# EAGLE design PT_2016_PB_4lyr_Rev3 (EAGLE 6.5.0)
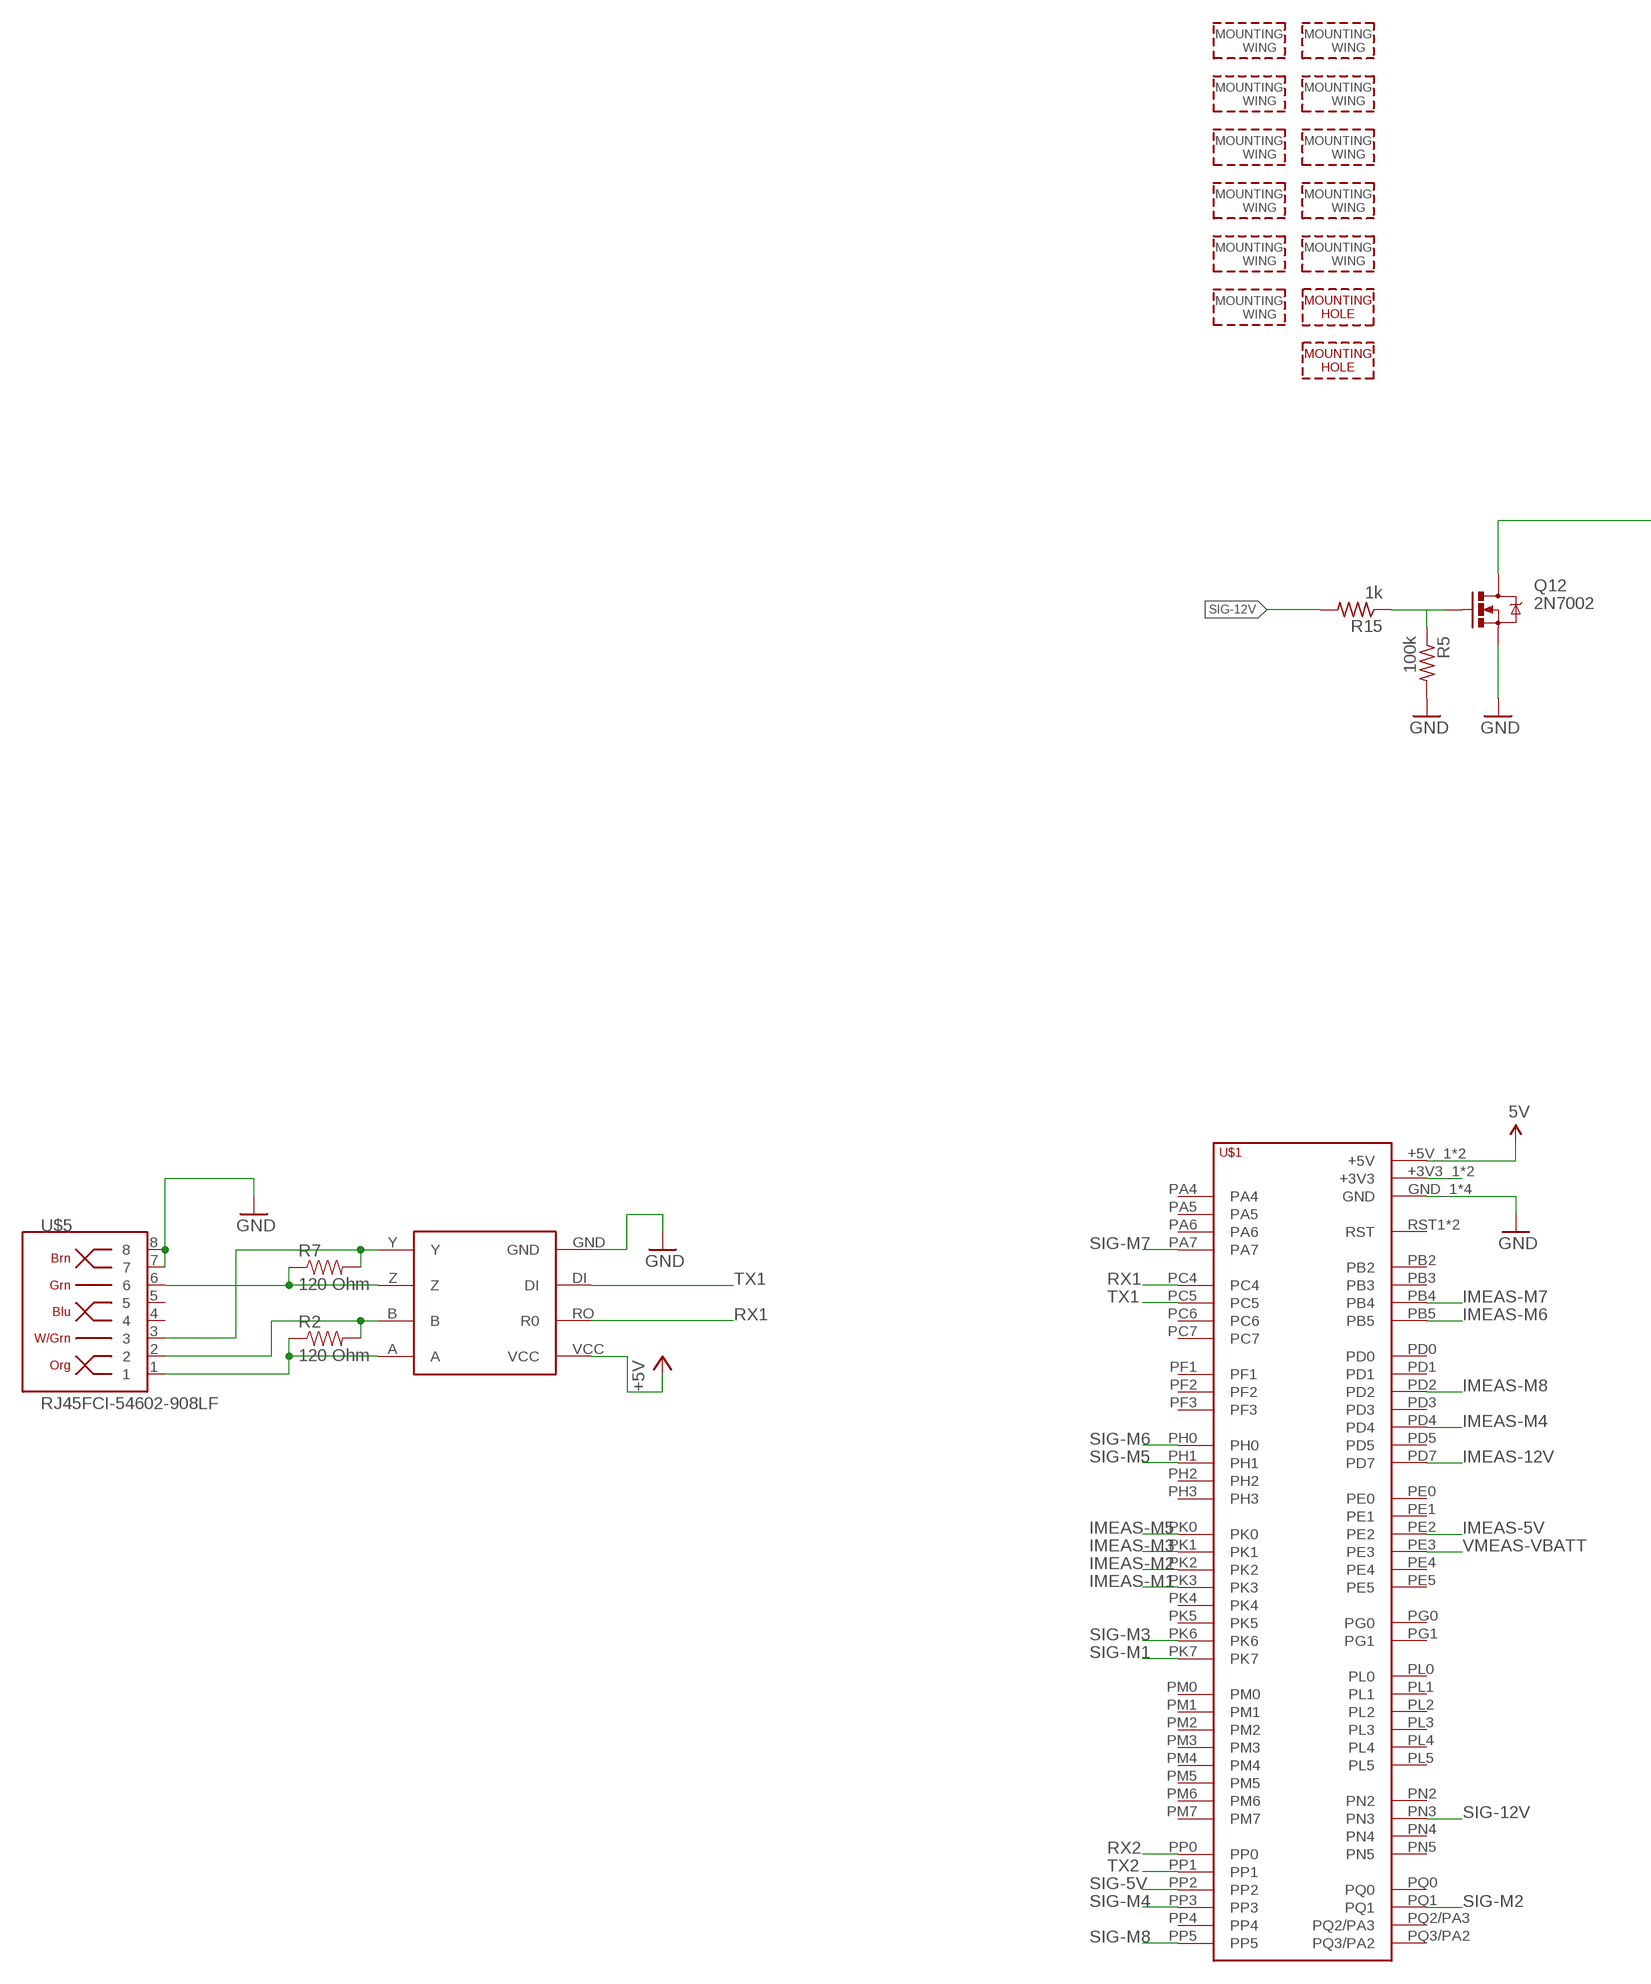
[diagram p0: schematic, sheet 1, part 1 of 3]
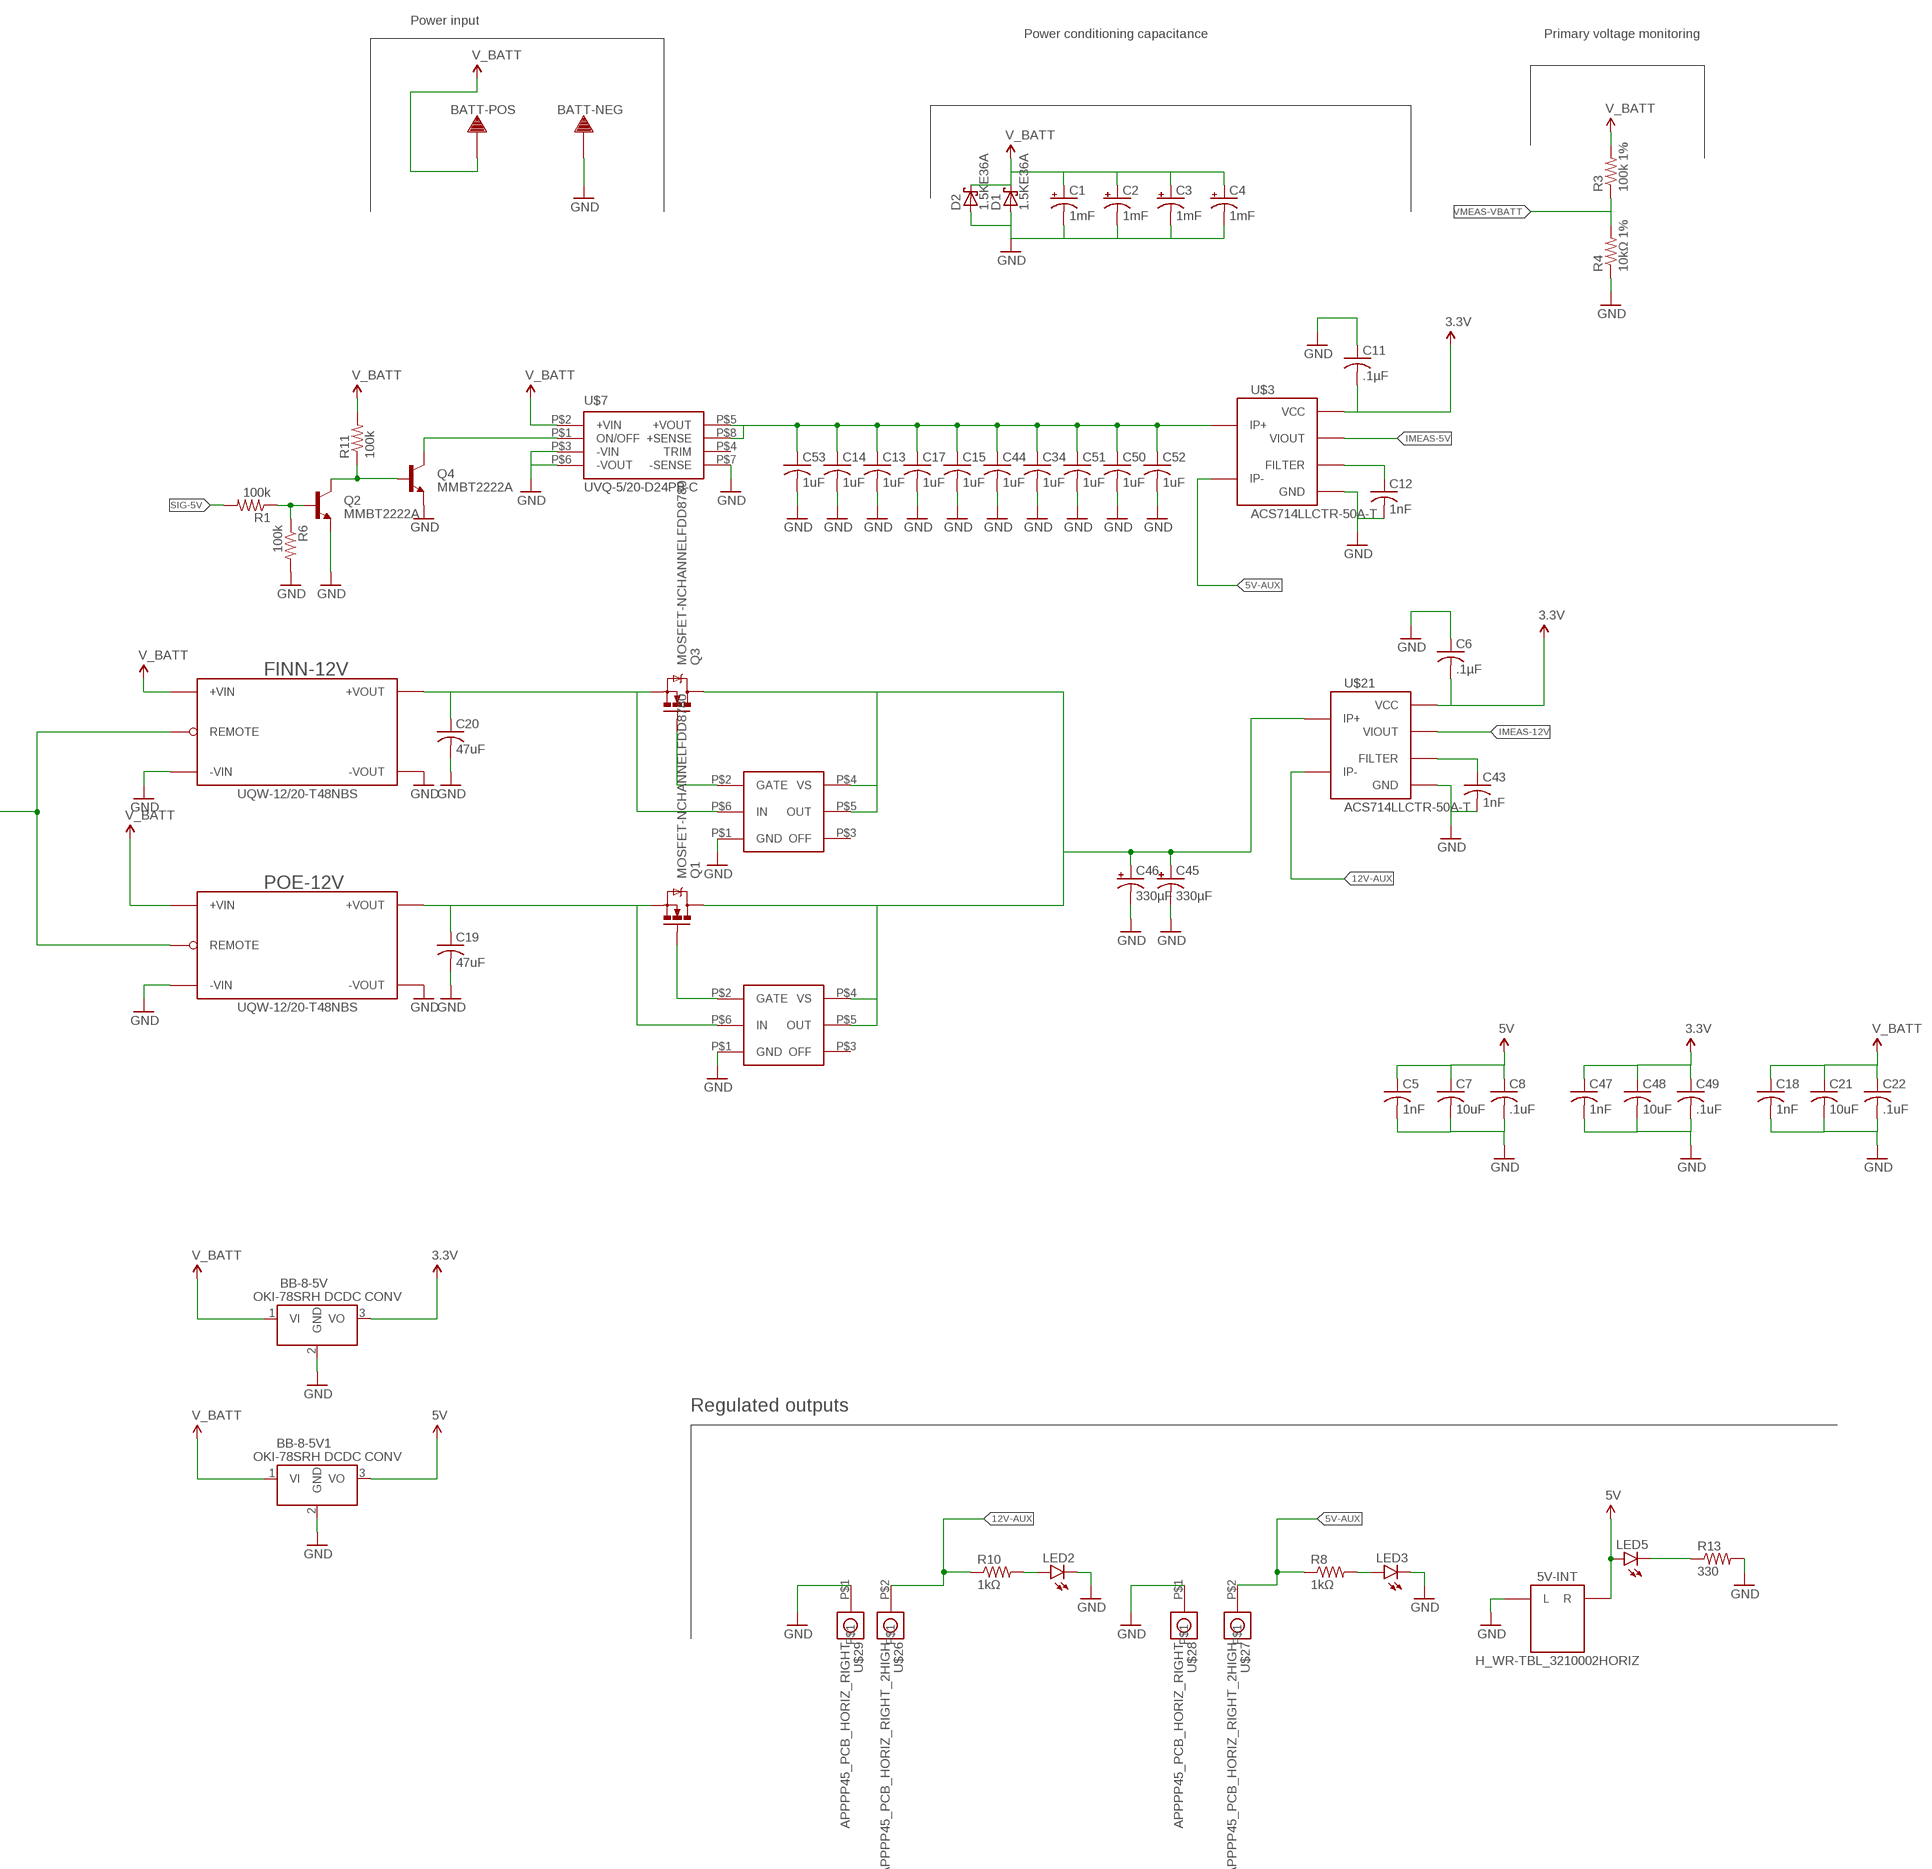
[diagram p1: schematic, sheet 1, part 2 of 3]
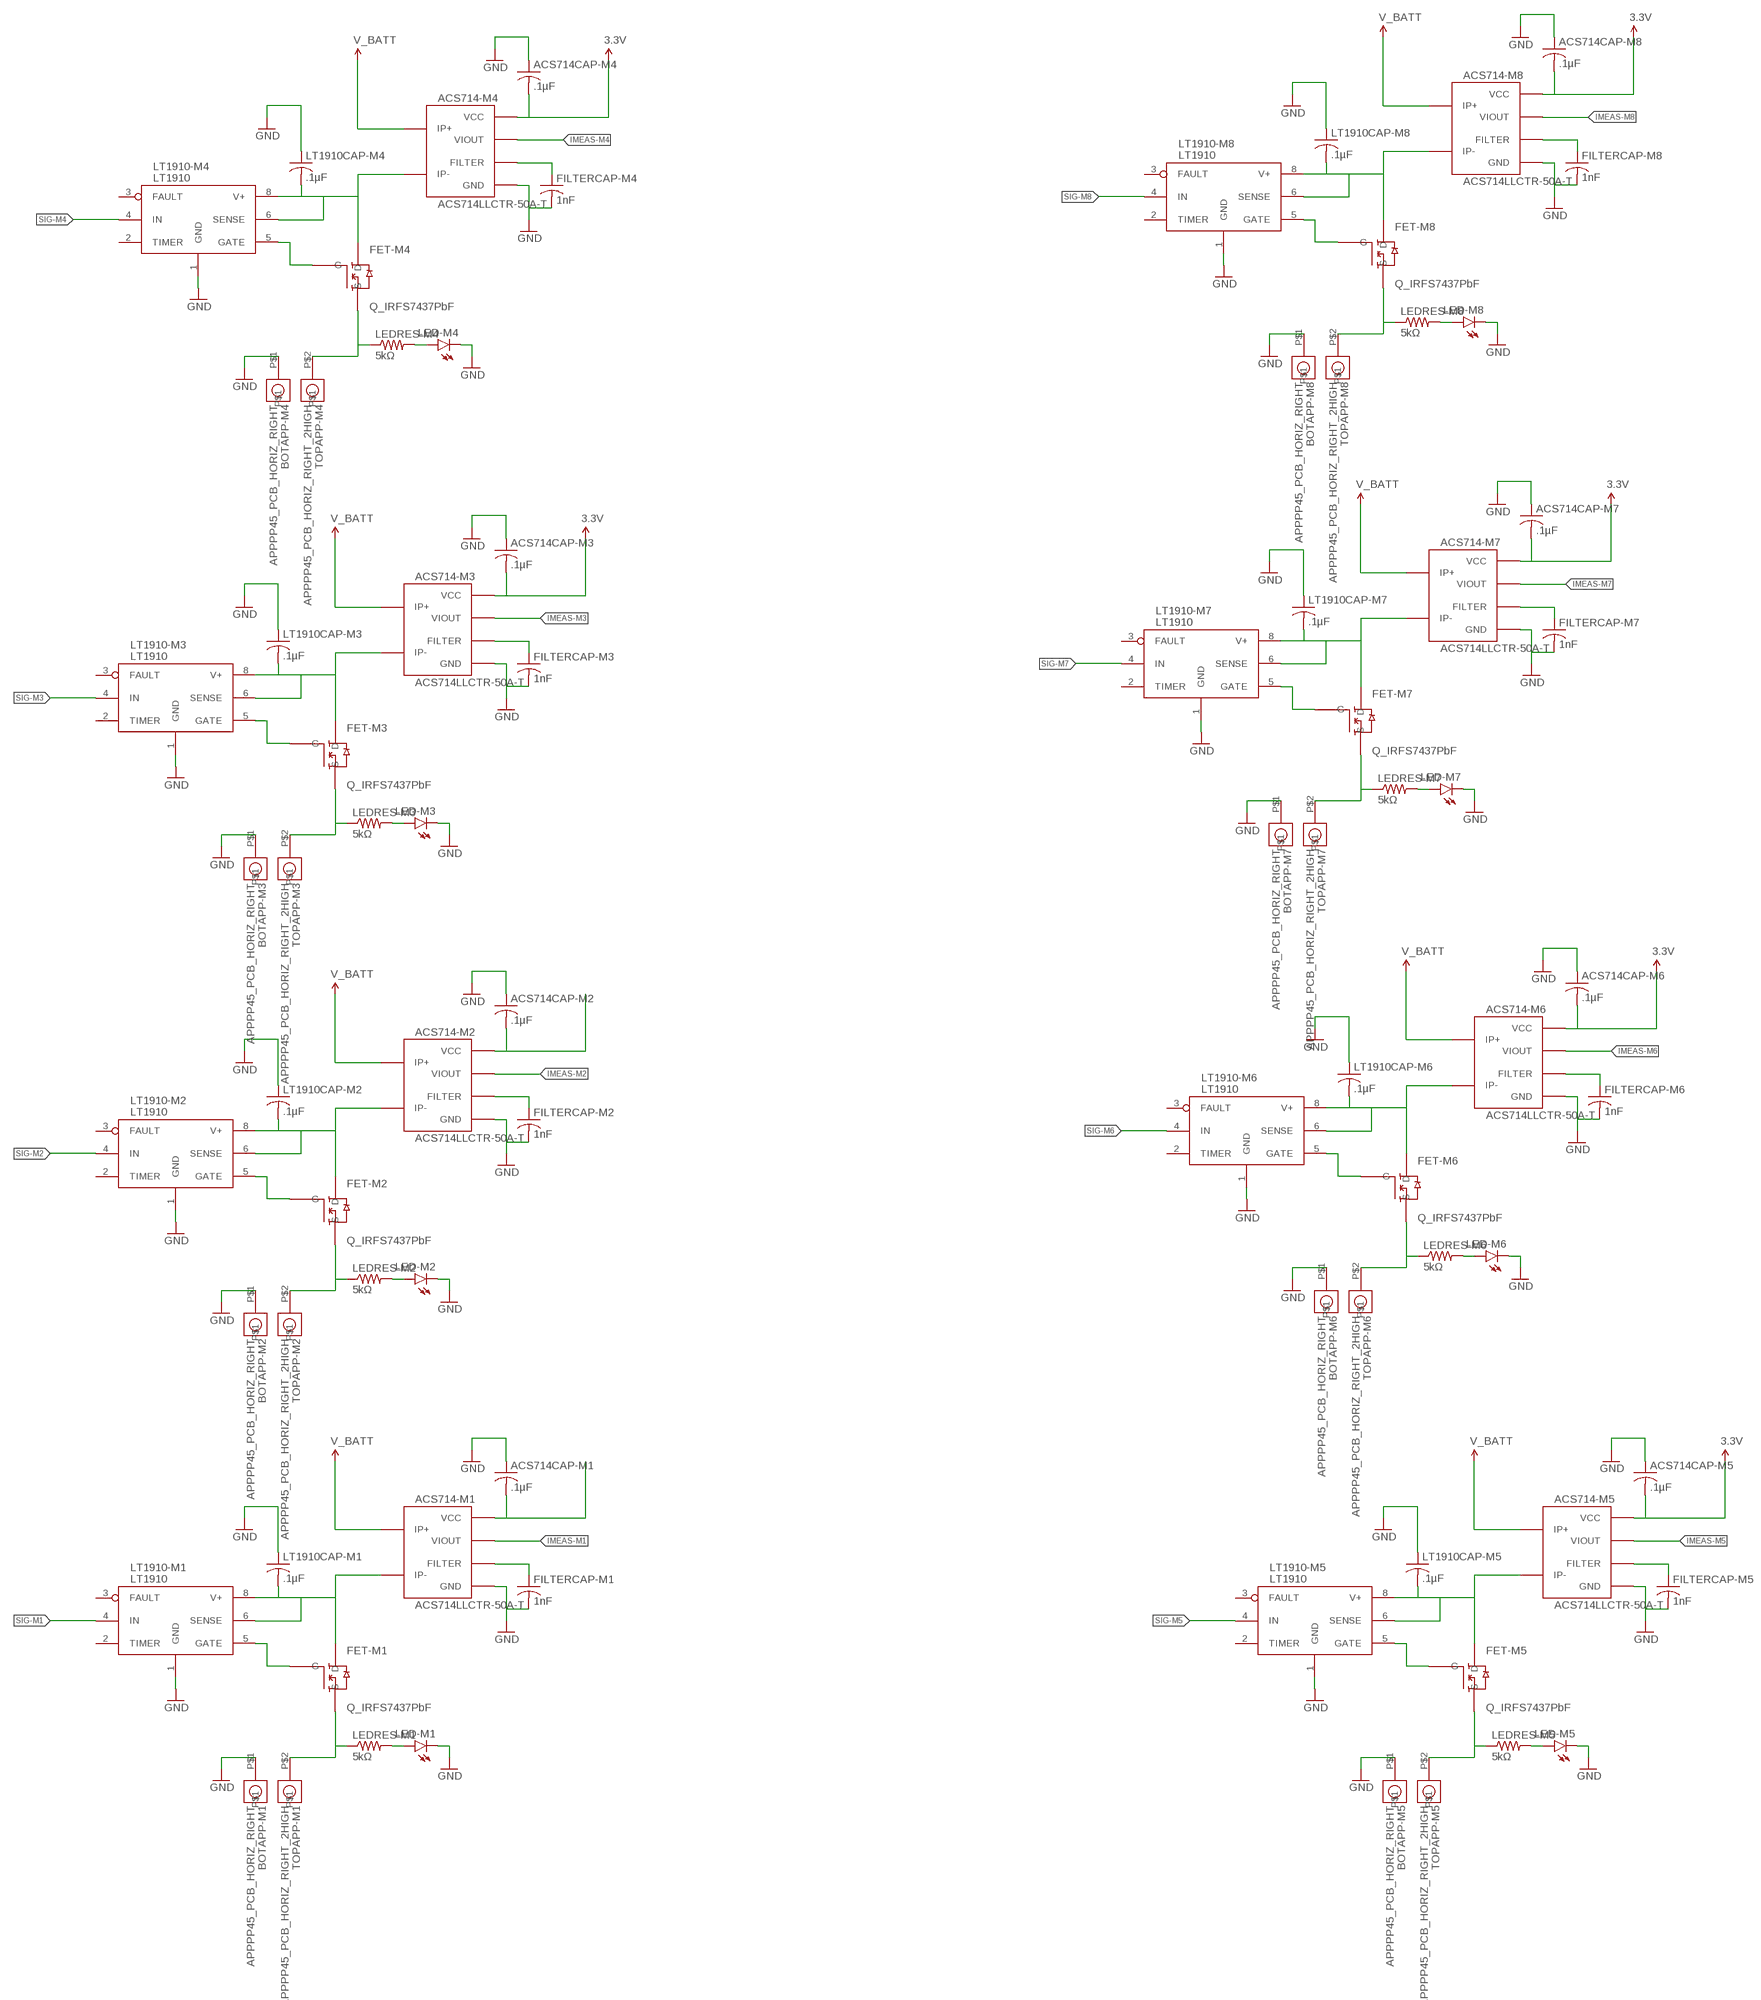
[diagram p2: schematic, sheet 1, part 3 of 3]

## Parts
5V-INT  H_WR-TBL_3210002HORIZ  [691322110002]
ACS714-M1  ACS714LLCTR-50A-T  Q_ACS714  [SOIC8_ACS711]
ACS714-M2  ACS714LLCTR-50A-T  Q_ACS714  [SOIC8_ACS711]
ACS714-M3  ACS714LLCTR-50A-T  Q_ACS714  [SOIC8_ACS711]
ACS714-M4  ACS714LLCTR-50A-T  Q_ACS714  [SOIC8_ACS711]
ACS714-M5  ACS714LLCTR-50A-T  Q_ACS714  [SOIC8_ACS711]
ACS714-M6  ACS714LLCTR-50A-T  Q_ACS714  [SOIC8_ACS711]
ACS714-M7  ACS714LLCTR-50A-T  Q_ACS714  [SOIC8_ACS711]
ACS714-M8  ACS714LLCTR-50A-T  Q_ACS714  [SOIC8_ACS711]
ACS714CAP-M1  .1µF  C-USC1206  [C1206]
ACS714CAP-M2  .1µF  C-USC1206  [C1206]
ACS714CAP-M3  .1µF  C-USC1206  [C1206]
ACS714CAP-M4  .1µF  C-USC1206  [C1206]
ACS714CAP-M5  .1µF  C-USC1206  [C1206]
ACS714CAP-M6  .1µF  C-USC1206  [C1206]
ACS714CAP-M7  .1µF  C-USC1206  [C1206]
ACS714CAP-M8  .1µF  C-USC1206  [C1206]
BATT-NEG  TERMINAL_HOLE  [LARGE_TERMINAL_HOLE]
BATT-POS  TERMINAL_HOLE  [LARGE_TERMINAL_HOLE]
BB-8-5V  Q_OKI-78SR  [OKI-78SR_HORIZ]
BB-8-5V1  Q_OKI-78SR  [OKI-78SR_HORIZ]
BOTAPP-M1  APPPP45_PCB_HORIZ_RIGHT  [APP45_PCB_HORIZ_RIGHT]
BOTAPP-M2  APPPP45_PCB_HORIZ_RIGHT  [APP45_PCB_HORIZ_RIGHT]
BOTAPP-M3  APPPP45_PCB_HORIZ_RIGHT  [APP45_PCB_HORIZ_RIGHT]
BOTAPP-M4  APPPP45_PCB_HORIZ_RIGHT  [APP45_PCB_HORIZ_RIGHT]
BOTAPP-M5  APPPP45_PCB_HORIZ_RIGHT  [APP45_PCB_HORIZ_RIGHT]
BOTAPP-M6  APPPP45_PCB_HORIZ_RIGHT  [APP45_PCB_HORIZ_RIGHT]
BOTAPP-M7  APPPP45_PCB_HORIZ_RIGHT  [APP45_PCB_HORIZ_RIGHT]
BOTAPP-M8  APPPP45_PCB_HORIZ_RIGHT  [APP45_PCB_HORIZ_RIGHT]
C1  1mF  C_POL12.5MM_NORMAL  [C_12.5MM]
C2  1mF  C_POL12.5MM_NORMAL  [C_12.5MM]
C3  1mF  C_POL12.5MM_NORMAL  [C_12.5MM]
C4  1mF  C_POL12.5MM_NORMAL  [C_12.5MM]
C5  1nF  C-USC1206  [C1206]
C6  .1µF  C-USC1206  [C1206]
C7  10uF  C-USC1206  [C1206]
C8  .1uF  C-USC1206  [C1206]
C11  .1µF  C-USC1206  [C1206]
C12  1nF  C-USC1206  [C1206]
C13  1uF  C-USC1206  [C1206]
C14  1uF  C-USC1206  [C1206]
C15  1uF  C-USC1206  [C1206]
C17  1uF  C-USC1206  [C1206]
C18  1nF  C-USC1206  [C1206]
C19  47uF  C-USC1206  [C1206]
C20  47uF  C-USC1206  [C1206]
C21  10uF  C-USC1206  [C1206]
C22  .1uF  C-USC1206  [C1206]
C34  1uF  C-USC1206  [C1206]
C43  1nF  C-USC1206  [C1206]
C44  1uF  C-USC1206  [C1206]
C45  330µF  CPOL-USE5-8.5  [E5-8,5]
C46  330µF  CPOL-USE5-8.5  [E5-8,5]
C47  1nF  C-USC1206  [C1206]
C48  10uF  C-USC1206  [C1206]
C49  .1uF  C-USC1206  [C1206]
C50  1uF  C-USC1206  [C1206]
C51  1uF  C-USC1206  [C1206]
C52  1uF  C-USC1206  [C1206]
C53  1uF  C-USC1206  [C1206]
D1  1.5KE36A  15KEXX  [CB429-17]
D2  1.5KE36A  15KEXX  [CB429-17]
FET-M1  Q_IRFS7437PbF  Q_IRF7437SMD  [D2PACK]
FET-M2  Q_IRFS7437PbF  Q_IRF7437SMD  [D2PACK]
FET-M3  Q_IRFS7437PbF  Q_IRF7437SMD  [D2PACK]
FET-M4  Q_IRFS7437PbF  Q_IRF7437SMD  [D2PACK]
FET-M5  Q_IRFS7437PbF  Q_IRF7437SMD  [D2PACK]
FET-M6  Q_IRFS7437PbF  Q_IRF7437SMD  [D2PACK]
FET-M7  Q_IRFS7437PbF  Q_IRF7437SMD  [D2PACK]
FET-M8  Q_IRFS7437PbF  Q_IRF7437SMD  [D2PACK]
FILTERCAP-M1  1nF  C-USC1206  [C1206]
FILTERCAP-M2  1nF  C-USC1206  [C1206]
FILTERCAP-M3  1nF  C-USC1206  [C1206]
FILTERCAP-M4  1nF  C-USC1206  [C1206]
FILTERCAP-M5  1nF  C-USC1206  [C1206]
FILTERCAP-M6  1nF  C-USC1206  [C1206]
FILTERCAP-M7  1nF  C-USC1206  [C1206]
FILTERCAP-M8  1nF  C-USC1206  [C1206]
FINN-12V  UQW-12/20-T48NBS  [U-T48-QB-NO_TRIM]
LED2  LED1206  [LED-1206]
LED3  LED1206  [LED-1206]
LED5  LED1206  [LED-1206]
LED-M1  LED1206  [LED-1206]
LED-M2  LED1206  [LED-1206]
LED-M3  LED1206  [LED-1206]
LED-M4  LED1206  [LED-1206]
LED-M5  LED1206  [LED-1206]
LED-M6  LED1206  [LED-1206]
LED-M7  LED1206  [LED-1206]
LED-M8  LED1206  [LED-1206]
LEDRES-M1  5kΩ  RESISTOR1206  [1206]
LEDRES-M2  5kΩ  RESISTOR1206  [1206]
LEDRES-M3  5kΩ  RESISTOR1206  [1206]
LEDRES-M4  5kΩ  RESISTOR1206  [1206]
LEDRES-M5  5kΩ  RESISTOR1206  [1206]
LEDRES-M6  5kΩ  RESISTOR1206  [1206]
LEDRES-M7  5kΩ  RESISTOR1206  [1206]
LEDRES-M8  5kΩ  RESISTOR1206  [1206]
LT1910-M1  LT1910  [SO8]
LT1910-M2  LT1910  [SO8]
LT1910-M3  LT1910  [SO8]
LT1910-M4  LT1910  [SO8]
LT1910-M5  LT1910  [SO8]
LT1910-M6  LT1910  [SO8]
LT1910-M7  LT1910  [SO8]
LT1910-M8  LT1910  [SO8]
LT1910CAP-M1  .1µF  C-USC1206  [C1206]
LT1910CAP-M2  .1µF  C-USC1206  [C1206]
LT1910CAP-M3  .1µF  C-USC1206  [C1206]
LT1910CAP-M4  .1µF  C-USC1206  [C1206]
LT1910CAP-M5  .1µF  C-USC1206  [C1206]
LT1910CAP-M6  .1µF  C-USC1206  [C1206]
LT1910CAP-M7  .1µF  C-USC1206  [C1206]
LT1910CAP-M8  .1µF  C-USC1206  [C1206]
POE-12V  UQW-12/20-T48NBS  [U-T48-QB-NO_TRIM]
Q1  MOSFET-NCHANNELFDD8780  [DPAK]
Q2  MMBT2222A  TRANSISTOR_NPNMMBT2222A  [SOT23-3]
Q3  MOSFET-NCHANNELFDD8780  [DPAK]
Q4  MMBT2222A  TRANSISTOR_NPNMMBT2222A  [SOT23-3]
Q12  2N7002  MOSFET-NCHANNEL2N7002PW  [SOT323]
R1  100k  RESISTOR1206  [1206]
R2  120 Ohm  RESISTOR1206  [1206]
R3  100k 1%  R-US_R1206  [R1206]
R4  10kΩ 1%  R-US_R1206  [R1206]
R5  100k  R-US_R1206  [R1206]
R6  100k  RESISTOR1206  [1206]
R7  120 Ohm  RESISTOR1206  [1206]
R8  1kΩ  RESISTOR1206  [1206]
R10  1kΩ  RESISTOR1206  [1206]
R11  100k  RESISTOR1206  [1206]
R13  330  RESISTOR1206  [1206]
R15  1k  R-US_R1206  [R1206]
TOPAPP-M1  APPPP45_PCB_HORIZ_RIGHT_2HIGH  [APP45_PCB_HORIZ_RIGHT_2HIGH]
TOPAPP-M2  APPPP45_PCB_HORIZ_RIGHT_2HIGH  [APP45_PCB_HORIZ_RIGHT_2HIGH]
TOPAPP-M3  APPPP45_PCB_HORIZ_RIGHT_2HIGH  [APP45_PCB_HORIZ_RIGHT_2HIGH]
TOPAPP-M4  APPPP45_PCB_HORIZ_RIGHT_2HIGH  [APP45_PCB_HORIZ_RIGHT_2HIGH]
TOPAPP-M5  APPPP45_PCB_HORIZ_RIGHT_2HIGH  [APP45_PCB_HORIZ_RIGHT_2HIGH]
TOPAPP-M6  APPPP45_PCB_HORIZ_RIGHT_2HIGH  [APP45_PCB_HORIZ_RIGHT_2HIGH]
TOPAPP-M7  APPPP45_PCB_HORIZ_RIGHT_2HIGH  [APP45_PCB_HORIZ_RIGHT_2HIGH]
TOPAPP-M8  APPPP45_PCB_HORIZ_RIGHT_2HIGH  [APP45_PCB_HORIZ_RIGHT_2HIGH]
U$1  TIVA-C-CONNECTED  [TIVA-C-CONNECTED]
U$2  APP_MOUTING_WINGHORIZ  [APP45_MOUNTING_WING_HORIZ]
U$3  ACS714LLCTR-50A-T  Q_ACS714  [SOIC8_ACS711]
U$4  APP_MOUTING_WINGHORIZ  [APP45_MOUNTING_WING_HORIZ]
U$5  RJ45FCI-54602-908LF  [FCI-54602-908LF]
U$6  LM5050  [LM5050]
U$7  UVQ-5/20-D24PB-C  [MURATA_5V_DC-DC_CONVERTER]
U$8  MOUNTING_HOLE#8  [#8_SCREW]
U$9  LM5050  [LM5050]
U$10  MOUNTING_HOLE#8  [#8_SCREW]
U$21  ACS714LLCTR-50A-T  Q_ACS714  [SOIC8_ACS711]
U$24  MAX3077  [MAX3070E]
U$25  APP_MOUTING_WINGHORIZ  [APP45_MOUNTING_WING_HORIZ]
U$26  APPPP45_PCB_HORIZ_RIGHT_2HIGH  [APP45_PCB_HORIZ_RIGHT_2HIGH]
U$27  APPPP45_PCB_HORIZ_RIGHT_2HIGH  [APP45_PCB_HORIZ_RIGHT_2HIGH]
U$28  APPPP45_PCB_HORIZ_RIGHT  [APP45_PCB_HORIZ_RIGHT]
U$29  APPPP45_PCB_HORIZ_RIGHT  [APP45_PCB_HORIZ_RIGHT]
U$30  APP_MOUTING_WINGHORIZ  [APP45_MOUNTING_WING_HORIZ]
U$31  APP_MOUTING_WINGHORIZ  [APP45_MOUNTING_WING_HORIZ]
U$32  APP_MOUTING_WINGHORIZ  [APP45_MOUNTING_WING_HORIZ]
U$33  APP_MOUTING_WINGHORIZ  [APP45_MOUNTING_WING_HORIZ]
U$34  APP_MOUTING_WINGHORIZ  [APP45_MOUNTING_WING_HORIZ]
U$35  APP_MOUTING_WINGHORIZ  [APP45_MOUNTING_WING_HORIZ]
U$41  APP_MOUTING_WINGHORIZ  [APP45_MOUNTING_WING_HORIZ]
U$42  APP_MOUTING_WINGHORIZ  [APP45_MOUNTING_WING_HORIZ]

## Nets
3.3V: ACS714-M1.8(VCC) ACS714-M2.8(VCC) ACS714-M3.8(VCC) ACS714-M4.8(VCC) ACS714-M5.8(VCC) ACS714-M6.8(VCC) ACS714-M7.8(VCC) ACS714-M8.8(VCC) ACS714CAP-M1.2 ACS714CAP-M2.2 ACS714CAP-M3.2 ACS714CAP-M4.2 ACS714CAP-M5.2 ACS714CAP-M6.2 ACS714CAP-M7.2 ACS714CAP-M8.2 BB-8-5V.3(VO) C6.2 C11.2 C47.1 C48.1 C49.1 U$3.8(VCC) U$21.8(VCC) U$24.VCC ; supply symbol labelled +5V
5V: 5V-INT.R BB-8-5V1.3(VO) C5.1 C7.1 C8.1 LED5.A U$1.+5V_1(+5V) U$1.+5V_2(+5V)
5V-AUX: R8.1 U$3.4(IP-) U$27.P$2
12V-AUX: R10.1 U$21.4(IP-) U$26.P$2
DRAIN-M1: ACS714-M1.4(IP-) FET-M1.TAB(D) LT1910-M1.6(SENSE) LT1910-M1.8(V+) LT1910CAP-M1.2
DRAIN-M2: ACS714-M2.4(IP-) FET-M2.TAB(D) LT1910-M2.6(SENSE) LT1910-M2.8(V+) LT1910CAP-M2.2
DRAIN-M3: ACS714-M3.4(IP-) FET-M3.TAB(D) LT1910-M3.6(SENSE) LT1910-M3.8(V+) LT1910CAP-M3.2
DRAIN-M4: ACS714-M4.4(IP-) FET-M4.TAB(D) LT1910-M4.6(SENSE) LT1910-M4.8(V+) LT1910CAP-M4.2
DRAIN-M5: ACS714-M5.4(IP-) FET-M5.TAB(D) LT1910-M5.6(SENSE) LT1910-M5.8(V+) LT1910CAP-M5.2
DRAIN-M6: ACS714-M6.4(IP-) FET-M6.TAB(D) LT1910-M6.6(SENSE) LT1910-M6.8(V+) LT1910CAP-M6.2
DRAIN-M7: ACS714-M7.4(IP-) FET-M7.TAB(D) LT1910-M7.6(SENSE) LT1910-M7.8(V+) LT1910CAP-M7.2
DRAIN-M8: ACS714-M8.4(IP-) FET-M8.TAB(D) LT1910-M8.6(SENSE) LT1910-M8.8(V+) LT1910CAP-M8.2
FILTER-M1: ACS714-M1.6(FILTER) FILTERCAP-M1.1
FILTER-M2: ACS714-M2.6(FILTER) FILTERCAP-M2.1
FILTER-M3: ACS714-M3.6(FILTER) FILTERCAP-M3.1
FILTER-M4: ACS714-M4.6(FILTER) FILTERCAP-M4.1
FILTER-M5: ACS714-M5.6(FILTER) FILTERCAP-M5.1
FILTER-M6: ACS714-M6.6(FILTER) FILTERCAP-M6.1
FILTER-M7: ACS714-M7.6(FILTER) FILTERCAP-M7.1
FILTER-M8: ACS714-M8.6(FILTER) FILTERCAP-M8.1
GATE-M1: FET-M1.1(G) LT1910-M1.5(GATE)
GATE-M2: FET-M2.1(G) LT1910-M2.5(GATE)
GATE-M3: FET-M3.1(G) LT1910-M3.5(GATE)
GATE-M4: FET-M4.1(G) LT1910-M4.5(GATE)
GATE-M5: FET-M5.1(G) LT1910-M5.5(GATE)
GATE-M6: FET-M6.1(G) LT1910-M6.5(GATE)
GATE-M7: FET-M7.1(G) LT1910-M7.5(GATE)
GATE-M8: FET-M8.1(G) LT1910-M8.5(GATE)
GND: 5V-INT.L ACS714-M1.5(GND) ACS714-M2.5(GND) ACS714-M3.5(GND) ACS714-M4.5(GND) ACS714-M5.5(GND) ACS714-M6.5(GND) ACS714-M7.5(GND) ACS714-M8.5(GND) ACS714CAP-M1.1 ACS714CAP-M2.1 ACS714CAP-M3.1 ACS714CAP-M4.1 ACS714CAP-M5.1 ACS714CAP-M6.1 ACS714CAP-M7.1 ACS714CAP-M8.1 BATT-NEG.P$1 BB-8-5V1.2(GND) BB-8-5V.2(GND) BOTAPP-M1.P$1 BOTAPP-M2.P$1 BOTAPP-M3.P$1 BOTAPP-M4.P$1 BOTAPP-M5.P$1 BOTAPP-M6.P$1 BOTAPP-M7.P$1 BOTAPP-M8.P$1 C1.- C2.- C3.- C4.- C5.2 C6.1 C7.2 C8.2 C11.1 C12.2 C13.2 C14.2 C15.2 C17.2 C18.2 C19.2 C20.2 C21.2 C22.2 C34.2 C43.2 C44.2 C45.- C46.- C47.2 C48.2 C49.2 C50.2 C51.2 C52.2 C53.2 D1.A D2.A FILTERCAP-M1.2 FILTERCAP-M2.2 FILTERCAP-M3.2 FILTERCAP-M4.2 FILTERCAP-M5.2 FILTERCAP-M6.2 FILTERCAP-M7.2 FILTERCAP-M8.2 FINN-12V.3(-VIN) FINN-12V.4(-VOUT) LED2.C LED3.C LED-M1.C LED-M2.C LED-M3.C LED-M4.C LED-M5.C LED-M6.C LED-M7.C LED-M8.C LT1910-M1.1(GND) LT1910-M2.1(GND) LT1910-M3.1(GND) LT1910-M4.1(GND) LT1910-M5.1(GND) LT1910-M6.1(GND) LT1910-M7.1(GND) LT1910-M8.1(GND) LT1910CAP-M1.1 LT1910CAP-M2.1 LT1910CAP-M3.1 LT1910CAP-M4.1 LT1910CAP-M5.1 LT1910CAP-M6.1 LT1910CAP-M7.1 LT1910CAP-M8.1 POE-12V.3(-VIN) POE-12V.4(-VOUT) Q2.2(E) Q4.2(E) Q12.2(S) R4.1 R5.2 R6.2 R13.2 U$1.GND_1(GND) U$1.GND_2(GND) U$1.GND_3(GND) U$1.GND_4(GND) U$3.5(GND) U$5.7 U$5.8 U$6.P$1(GND) U$7.P$3(-VIN) U$7.P$6(-VOUT) U$7.P$7(-SENSE) U$9.P$1(GND) U$21.5(GND) U$24.GND U$28.P$1 U$29.P$1
IMEAS-5V: U$1.PE2 U$3.7(VIOUT)
IMEAS-12V: U$1.PD7 U$21.7(VIOUT)
IMEAS-M1: ACS714-M1.7(VIOUT) U$1.PK3
IMEAS-M2: ACS714-M2.7(VIOUT) U$1.PK2
IMEAS-M3: ACS714-M3.7(VIOUT) U$1.PK1
IMEAS-M4: ACS714-M4.7(VIOUT) U$1.PD4
IMEAS-M5: ACS714-M5.7(VIOUT) U$1.PK0
IMEAS-M6: ACS714-M6.7(VIOUT) U$1.PB5
IMEAS-M7: ACS714-M7.7(VIOUT) U$1.PB4
IMEAS-M8: ACS714-M8.7(VIOUT) U$1.PD2
LEDLINE-M1: LED-M1.A LEDRES-M1.2
LEDLINE-M2: LED-M2.A LEDRES-M2.2
LEDLINE-M3: LED-M3.A LEDRES-M3.2
LEDLINE-M4: LED-M4.A LEDRES-M4.2
LEDLINE-M5: LED-M5.A LEDRES-M5.2
LEDLINE-M6: LED-M6.A LEDRES-M6.2
LEDLINE-M7: LED-M7.A LEDRES-M7.2
LEDLINE-M8: LED-M8.A LEDRES-M8.2
N$1: C20.1 FINN-12V.8(+VOUT) Q3.3(S) U$6.P$6(IN)
N$2: C19.1 POE-12V.8(+VOUT) Q1.3(S) U$9.P$6(IN)
N$3: Q3.1(G) U$6.P$2(GATE)
N$4: FINN-12V.2(REMOTE) POE-12V.2(REMOTE) Q12.3(D)
N$5: Q1.1(G) U$9.P$2(GATE)
N$6: LED5.C R13.1
N$11: Q4.3(C) U$7.P$1(ON/OFF)
N$12: C43.1 U$21.6(FILTER)
N$14: Q2.1(B) R1.1 R6.1
N$15: Q2.3(C) Q4.1(B) R11.1
N$33: C45.+ C46.+ Q1.4(D) Q3.4(D) U$6.P$4(VS) U$6.P$5(OUT) U$9.P$4(VS) U$9.P$5(OUT) U$21.1(IP+)
N$34: LED3.A R8.2
N$38: C12.1 U$3.6(FILTER)
N$46: LED2.A R10.2
N$71: C13.1 C14.1 C15.1 C17.1 C34.1 C44.1 C50.1 C51.1 C52.1 C53.1 U$3.1(IP+) U$7.P$5(+VOUT) U$7.P$8(+SENSE)
N$98: U$1.+3V3_1(+3V3) U$1.+3V3_2(+3V3)
N$114: Q12.1(G) R5.1 R15.1
REC+1: R2.1 U$5.1 U$24.A
REC-1: R2.2 U$5.2 U$24.B
RX1: U$1.PC4 U$24.RO(R0)
RX2: U$1.PP0
SIG-5V: R1.2 U$1.PP2
SIG-12V: R15.2 U$1.PN3
SIG-M1: LT1910-M1.4(IN) U$1.PK7
SIG-M2: LT1910-M2.4(IN) U$1.PQ1
SIG-M3: LT1910-M3.4(IN) U$1.PK6
SIG-M4: LT1910-M4.4(IN) U$1.PP3
SIG-M5: LT1910-M5.4(IN) U$1.PH1
SIG-M6: LT1910-M6.4(IN) U$1.PH0
SIG-M7: LT1910-M7.4(IN) U$1.PA7
SIG-M8: LT1910-M8.4(IN) U$1.PP5
SOURCE-M1: FET-M1.2(S) LEDRES-M1.1 TOPAPP-M1.P$2
SOURCE-M2: FET-M2.2(S) LEDRES-M2.1 TOPAPP-M2.P$2
SOURCE-M3: FET-M3.2(S) LEDRES-M3.1 TOPAPP-M3.P$2
SOURCE-M4: FET-M4.2(S) LEDRES-M4.1 TOPAPP-M4.P$2
SOURCE-M5: FET-M5.2(S) LEDRES-M5.1 TOPAPP-M5.P$2
SOURCE-M6: FET-M6.2(S) LEDRES-M6.1 TOPAPP-M6.P$2
SOURCE-M7: FET-M7.2(S) LEDRES-M7.1 TOPAPP-M7.P$2
SOURCE-M8: FET-M8.2(S) LEDRES-M8.1 TOPAPP-M8.P$2
TRANS+1: R7.2 U$5.3 U$24.Y
TRANS-1: R7.1 U$5.6 U$24.Z
TX1: U$1.PC5 U$24.DI
TX2: U$1.PP1
V_BATT: ACS714-M1.1(IP+) ACS714-M2.1(IP+) ACS714-M3.1(IP+) ACS714-M4.1(IP+) ACS714-M5.1(IP+) ACS714-M6.1(IP+) ACS714-M7.1(IP+) ACS714-M8.1(IP+) BATT-POS.P$1 BB-8-5V1.1(VI) BB-8-5V.1(VI) C1.+ C2.+ C3.+ C4.+ C18.1 C21.1 C22.1 D1.C D2.C FINN-12V.1(+VIN) POE-12V.1(+VIN) R3.2 R11.2 U$7.P$2(+VIN)
VMEAS-VBATT: R3.1 R4.2 U$1.PE3
Unconnected: LT1910-M1.2(TIMER) LT1910-M1.3(FAULT) LT1910-M2.2(TIMER) LT1910-M2.3(FAULT) LT1910-M3.2(TIMER) LT1910-M3.3(FAULT) LT1910-M4.2(TIMER) LT1910-M4.3(FAULT) LT1910-M5.2(TIMER) LT1910-M5.3(FAULT) LT1910-M6.2(TIMER) LT1910-M6.3(FAULT) LT1910-M7.2(TIMER) LT1910-M7.3(FAULT) LT1910-M8.2(TIMER) LT1910-M8.3(FAULT) U$1.PA4 U$1.PA5 U$1.PA6 U$1.PB2 U$1.PB3 U$1.PC6 U$1.PC7 U$1.PD0 U$1.PD1 U$1.PD3 U$1.PD5 U$1.PE0 U$1.PE1 U$1.PE4 U$1.PE5 U$1.PF1 U$1.PF2 U$1.PF3 U$1.PG0 U$1.PG1 U$1.PH2 U$1.PH3 U$1.PK4 U$1.PK5 U$1.PL0 U$1.PL1 U$1.PL2 U$1.PL3 U$1.PL4 U$1.PL5 U$1.PM0 U$1.PM1 U$1.PM2 U$1.PM3 U$1.PM4 U$1.PM5 U$1.PM6 U$1.PM7 U$1.PN2 U$1.PN4 U$1.PN5 U$1.PP4 U$1.PQ0 U$1.PQ2/PA3 U$1.PQ3/PA2 U$1.RST1(RST) U$1.RST_2(RST) U$5.4 U$5.5 U$6.P$3(OFF) U$7.P$4(TRIM) U$9.P$3(OFF)

## Notes on the sheet
- Power input
- Power conditioning capacitance | Primary voltage monitoring
- Regulated outputs

## Library data of the parts
5V-INT = MRDT-2015-PowerBoard:H_WR-TBL_32*1*0002: Wurth Electronic's 2-pin 10A pluggable screw terminal headers. Vertical and Horizantal Part Numbers: 691322110002 (Horizantal) 691321100002 (Vertical); DIGIKEY_PN: 732-2769-ND
ACS714-M1-ACS714-M8 U$3 U$21 = MRDT-2015-PowerBoard:Q_ACS714: Sketch variant has increased clearance for traces.
ACS714CAP-M1-ACS714CAP-M8 C5-C8 C11-C15 C17-C22 C34 C43 C44 C47-C53 FILTERCAP-M1-FILTERCAP-M8 LT1910CAP-M1-LT1910CAP-M8 = resistor:C-US: CAPACITOR, American symbol
BATT-NEG BATT-POS = MRDT-2015-PowerBoard:TERMINAL_HOLE
BB-8-5V BB-8-5V1 = MRDT-2015-PowerBoard:Q_OKI-78SR: 4.95W DC/DC Converter Manufacturer: Murata Part Number: OKI-78SR-5/1.5-W36H-C OKI-78SR-3.3/1.5-W36H-C
BOTAPP-M1-BOTAPP-M8 TOPAPP-M1-TOPAPP-M8 U$26-U$29 = MRDT-Connectors:APP: http://www.powerwerx.com/anderson-powerpoles/
C1-C4 = MRDT-2014-All:C_POL: Alum Elect. Cap with 10mm diameter, 5mm lead spacing and 0.7mm lead diameter
C45 C46 = resistor:CPOL-US: POLARIZED CAPACITOR, American symbol
D1 D2 = diode:15KEXX: DIODE
FET-M1-FET-M8 = MRDT-2015-PowerBoard:Q_IRF*7437: 40V 195A N-CH MOSFET switch with heatsink
FINN-12V POE-12V = MRDT-2015-PowerBoard:UQW-12/20-T48NBS
LED2 LED3 LED5 LED-M1-LED-M8 = SparkFun-LED:LED: LEDs Standard schematic elements and footprints for 5mm, 3mm, 1206, and 0603 sized LEDs. 5mm - Spark Fun Electronics SKU : COM-00529 (and others)
LEDRES-M1-LEDRES-M8 R1 R2 R6-R8 R10 R11 R13 = SparkFun-Passives:RESISTOR: Resistor Basic schematic elements and footprints for 0603, 1206, and PTH resistors.
LT1910-M1-LT1910-M8 = Jake:LT1910
Q1 Q3 = SparkFun-DiscreteSemi:MOSFET-NCHANNEL: Common NMOSFET Parts MFG P/N Store ID Prod ID FDD8780 TRANS-09984 SI7820DN TRANS-11055 FDS6630A IC-08089 2N7002PW TRANS-11151 FQP30N06L COM-10213 TRANS-10060 BSS123LT1G TRANS-08345 BSS138 TRANS-00830 BS170 2N7000; PROD_ID: TRANS-09984
Q2 Q4 = SparkFun-DiscreteSemi:TRANSISTOR_NPN: Generic NPN BJT MMBT2222A - TRANS-08049 (SOT-23, 1A 40V) MPSA42 - TRANS-09116 (SOT-23, 500mA 300V) MMBT5088LT1G - TRANS-11160 (SOT-23, 50 mA 30V) BC547 - COM-08928 <http://www.sparkfun.com/products/8928> (TO-92 45V 100mA) (1.Collector 2.Base 3.Emitter) 2N3904 - COM-00521 <http://www.sparkfun.com/products/521> (TO-92 40V 200mA) (1.Emitter 2.Base 3.Collector) P2N2222A - COM-12852 <http://www.sparkfun.com/products/12852> (TO-92 40V 600mA) (1.Collector 2.Base 3.Emitter); PROD_ID: TRANS-08049
Q12 = SparkFun-DiscreteSemi:MOSFET-NCHANNEL: Common NMOSFET Parts MFG P/N Store ID Prod ID FDD8780 TRANS-09984 SI7820DN TRANS-11055 FDS6630A IC-08089 2N7002PW TRANS-11151 FQP30N06L COM-10213 TRANS-10060 BSS123LT1G TRANS-08345 BSS138 TRANS-00830 BS170 2N7000; PROD_ID: TRANS-11151
R3-R5 R15 = resistor:R-US_: RESISTOR, American symbol
U$1 = MRDT-2015-General:TIVA-C-CONNECTED: TIVA C CONNECTED LAUNCHPAD
U$2 U$4 U$25 U$30-U$35 U$41 U$42 = MRDT-Connectors:APP_MOUTING_WING
U$5 = MRDT-2015-General:RJ45
U$6 U$9 = LM5050:LM5050
U$7 = MRDT-2015-PowerBoard:UVQ-5/20-D24PB-C
U$8 U$10 = MRDT-Hardware:MOUNTING_HOLE: Mounting hole for M6 bolt. Standard use mounting hole for: Tiva C Connected - M6 Anderson Powerpole Mounting Wing - M8 Most frame-mounted PCB's - M8
U$24 = MAX3077:MAX3077

## Board
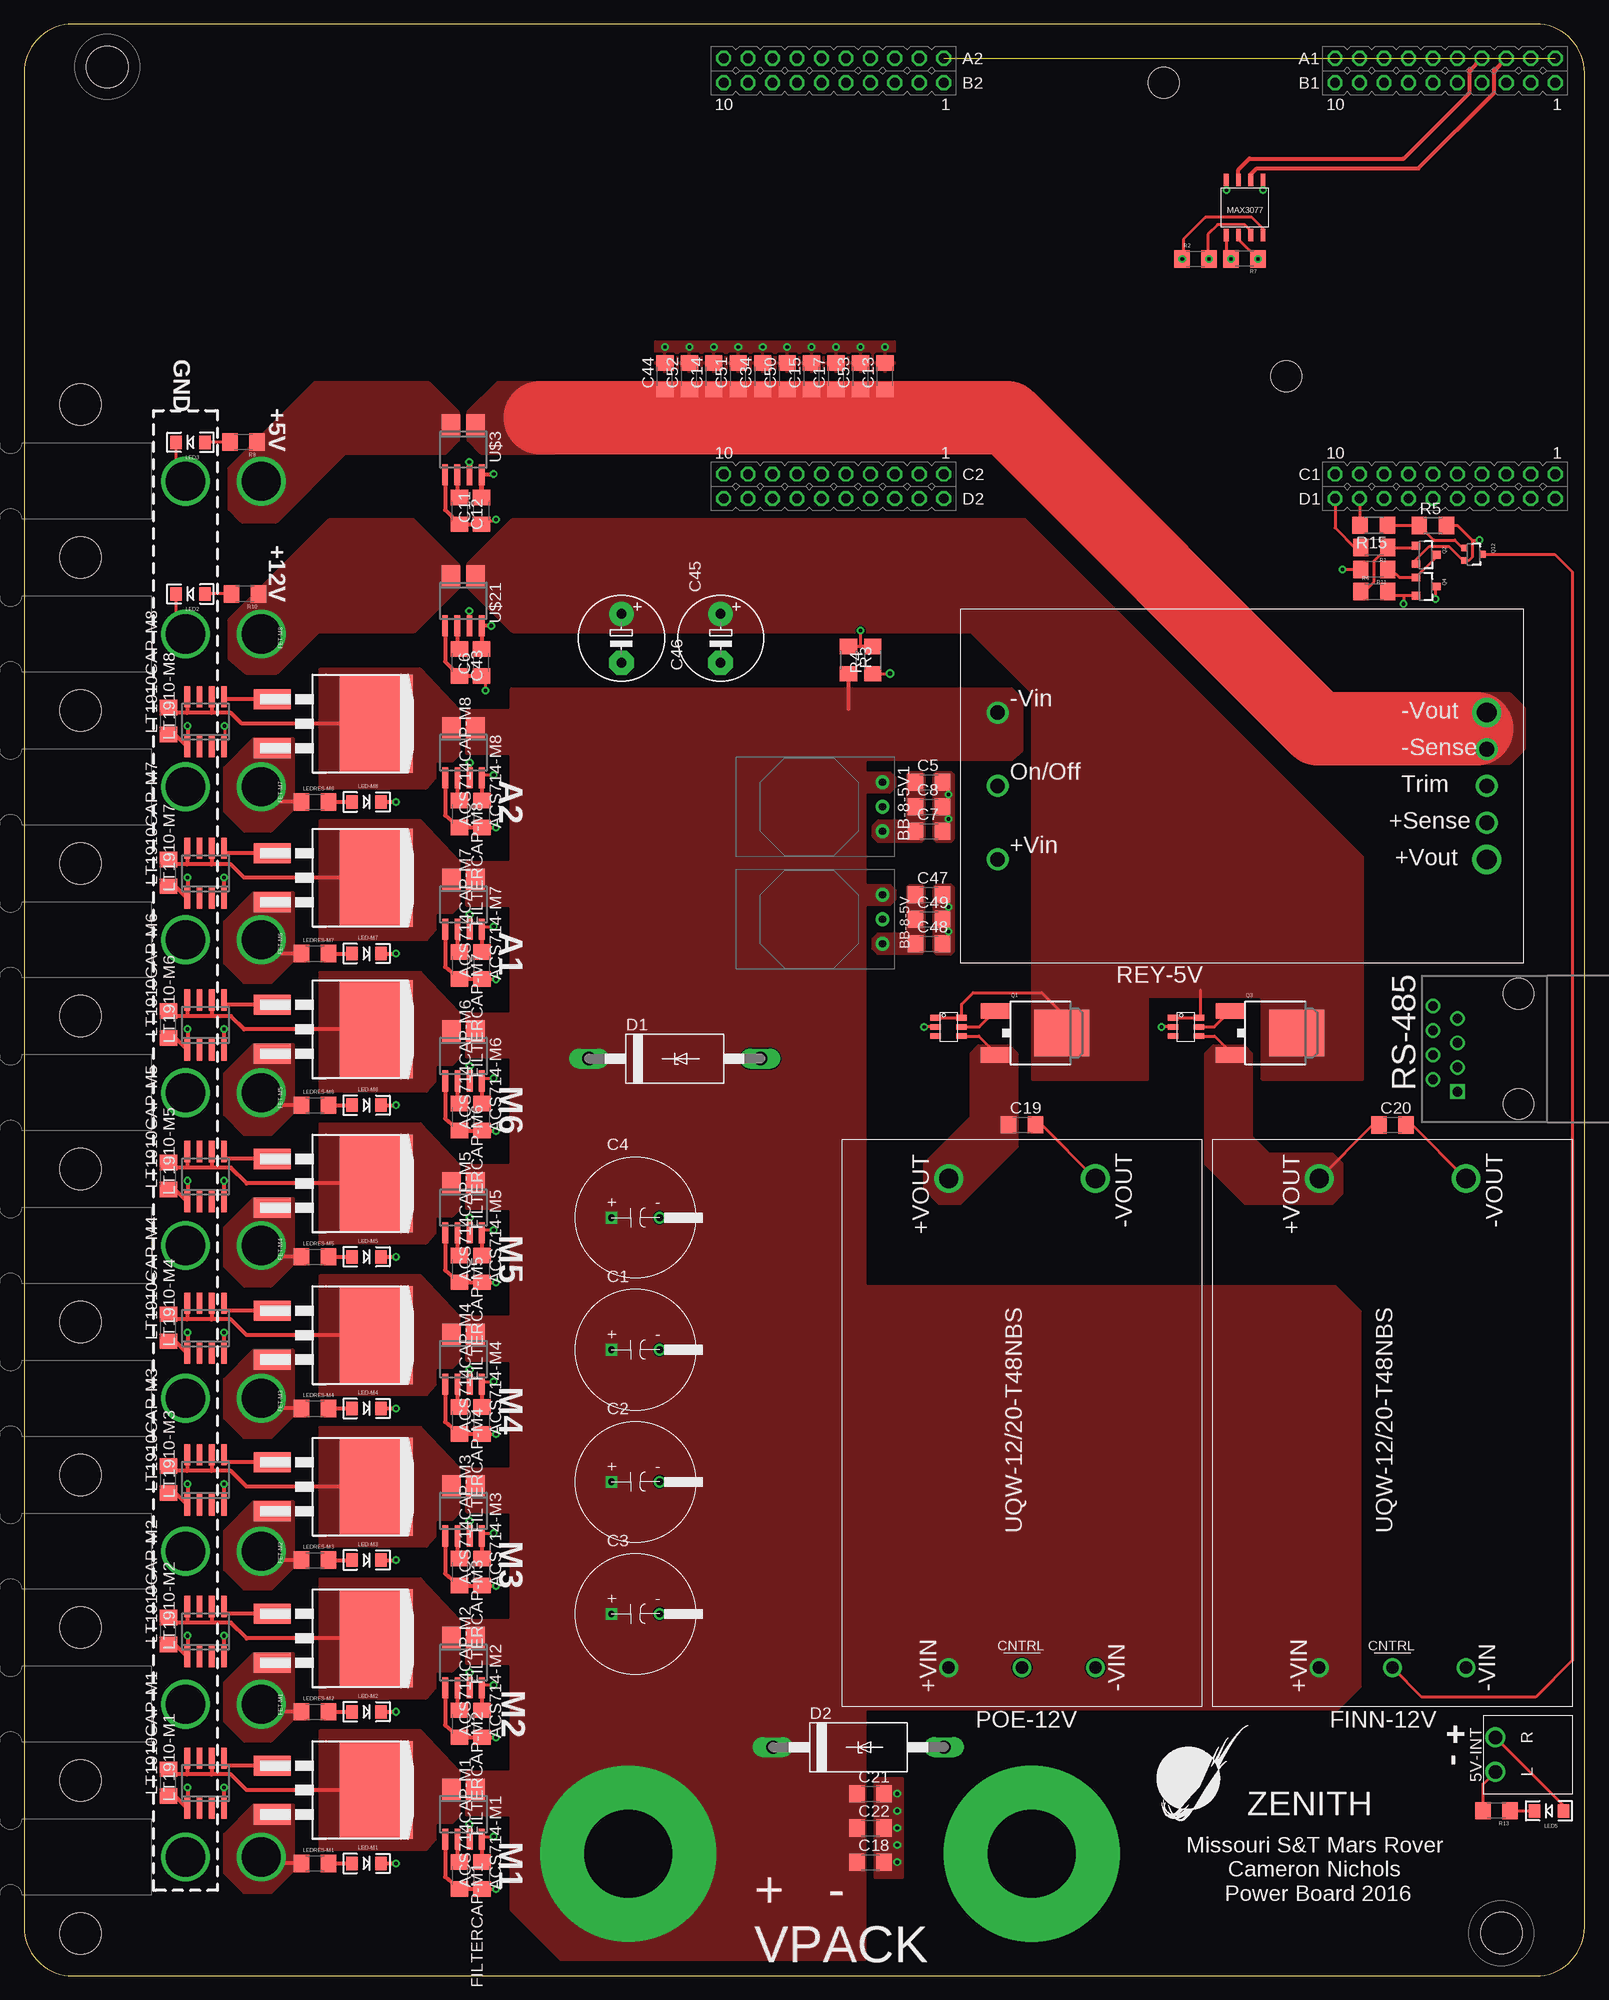
[diagram p3: board, top side]
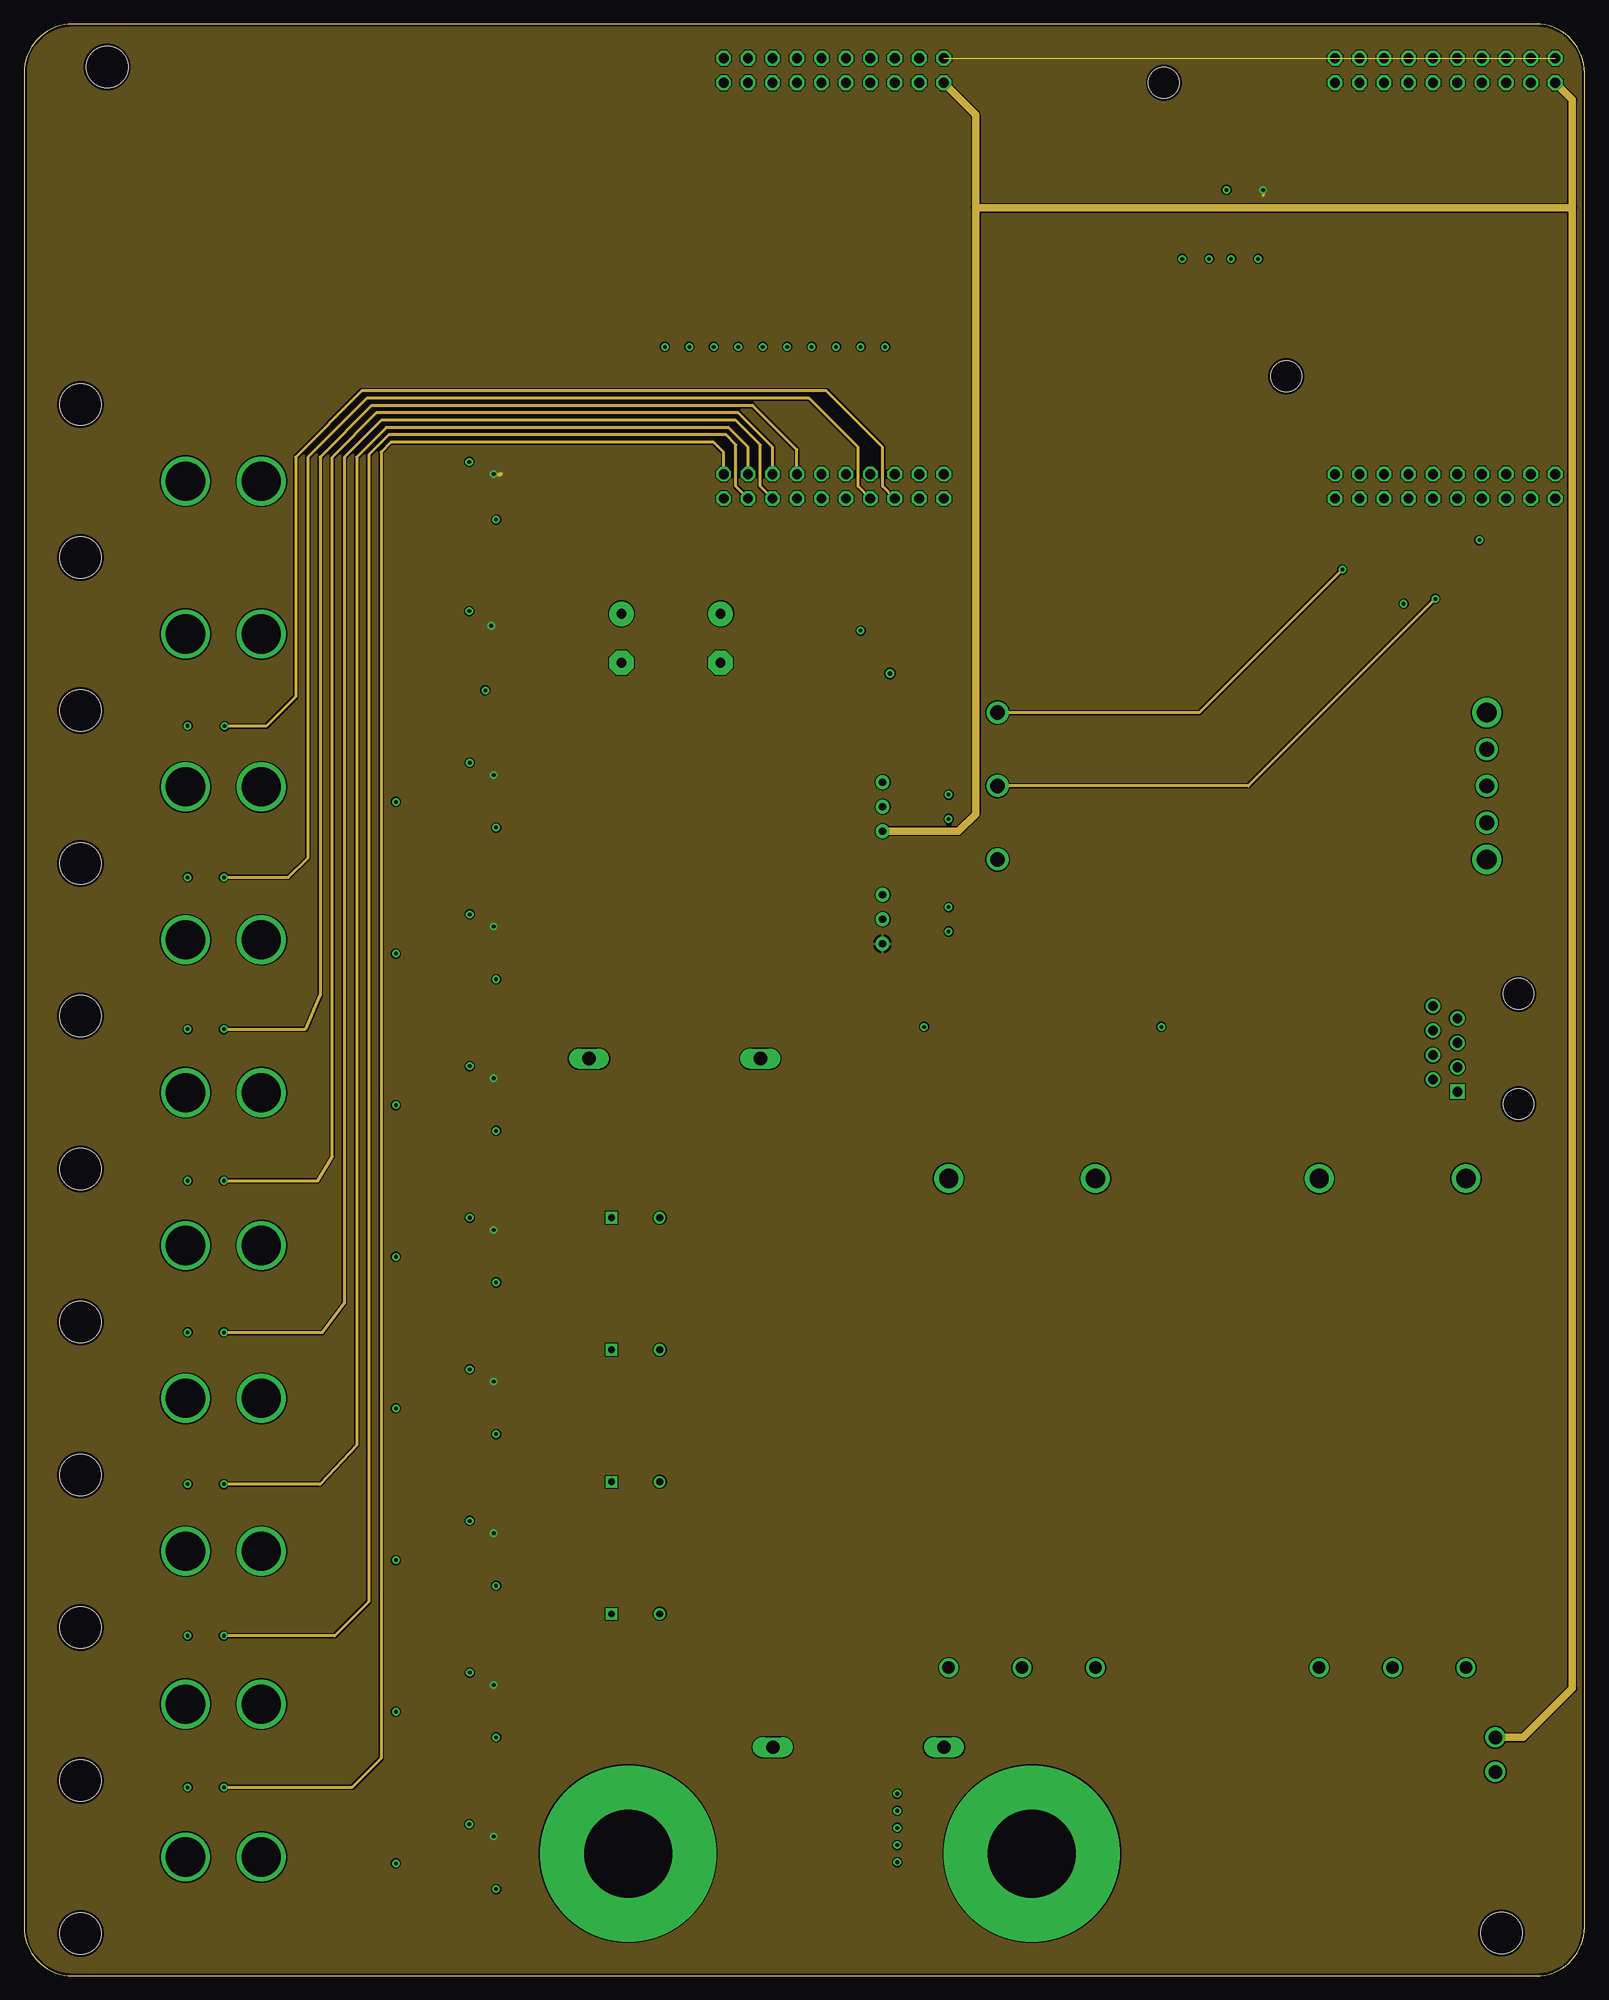
[diagram p4: board, inner layer Top-Mid(3.3)]
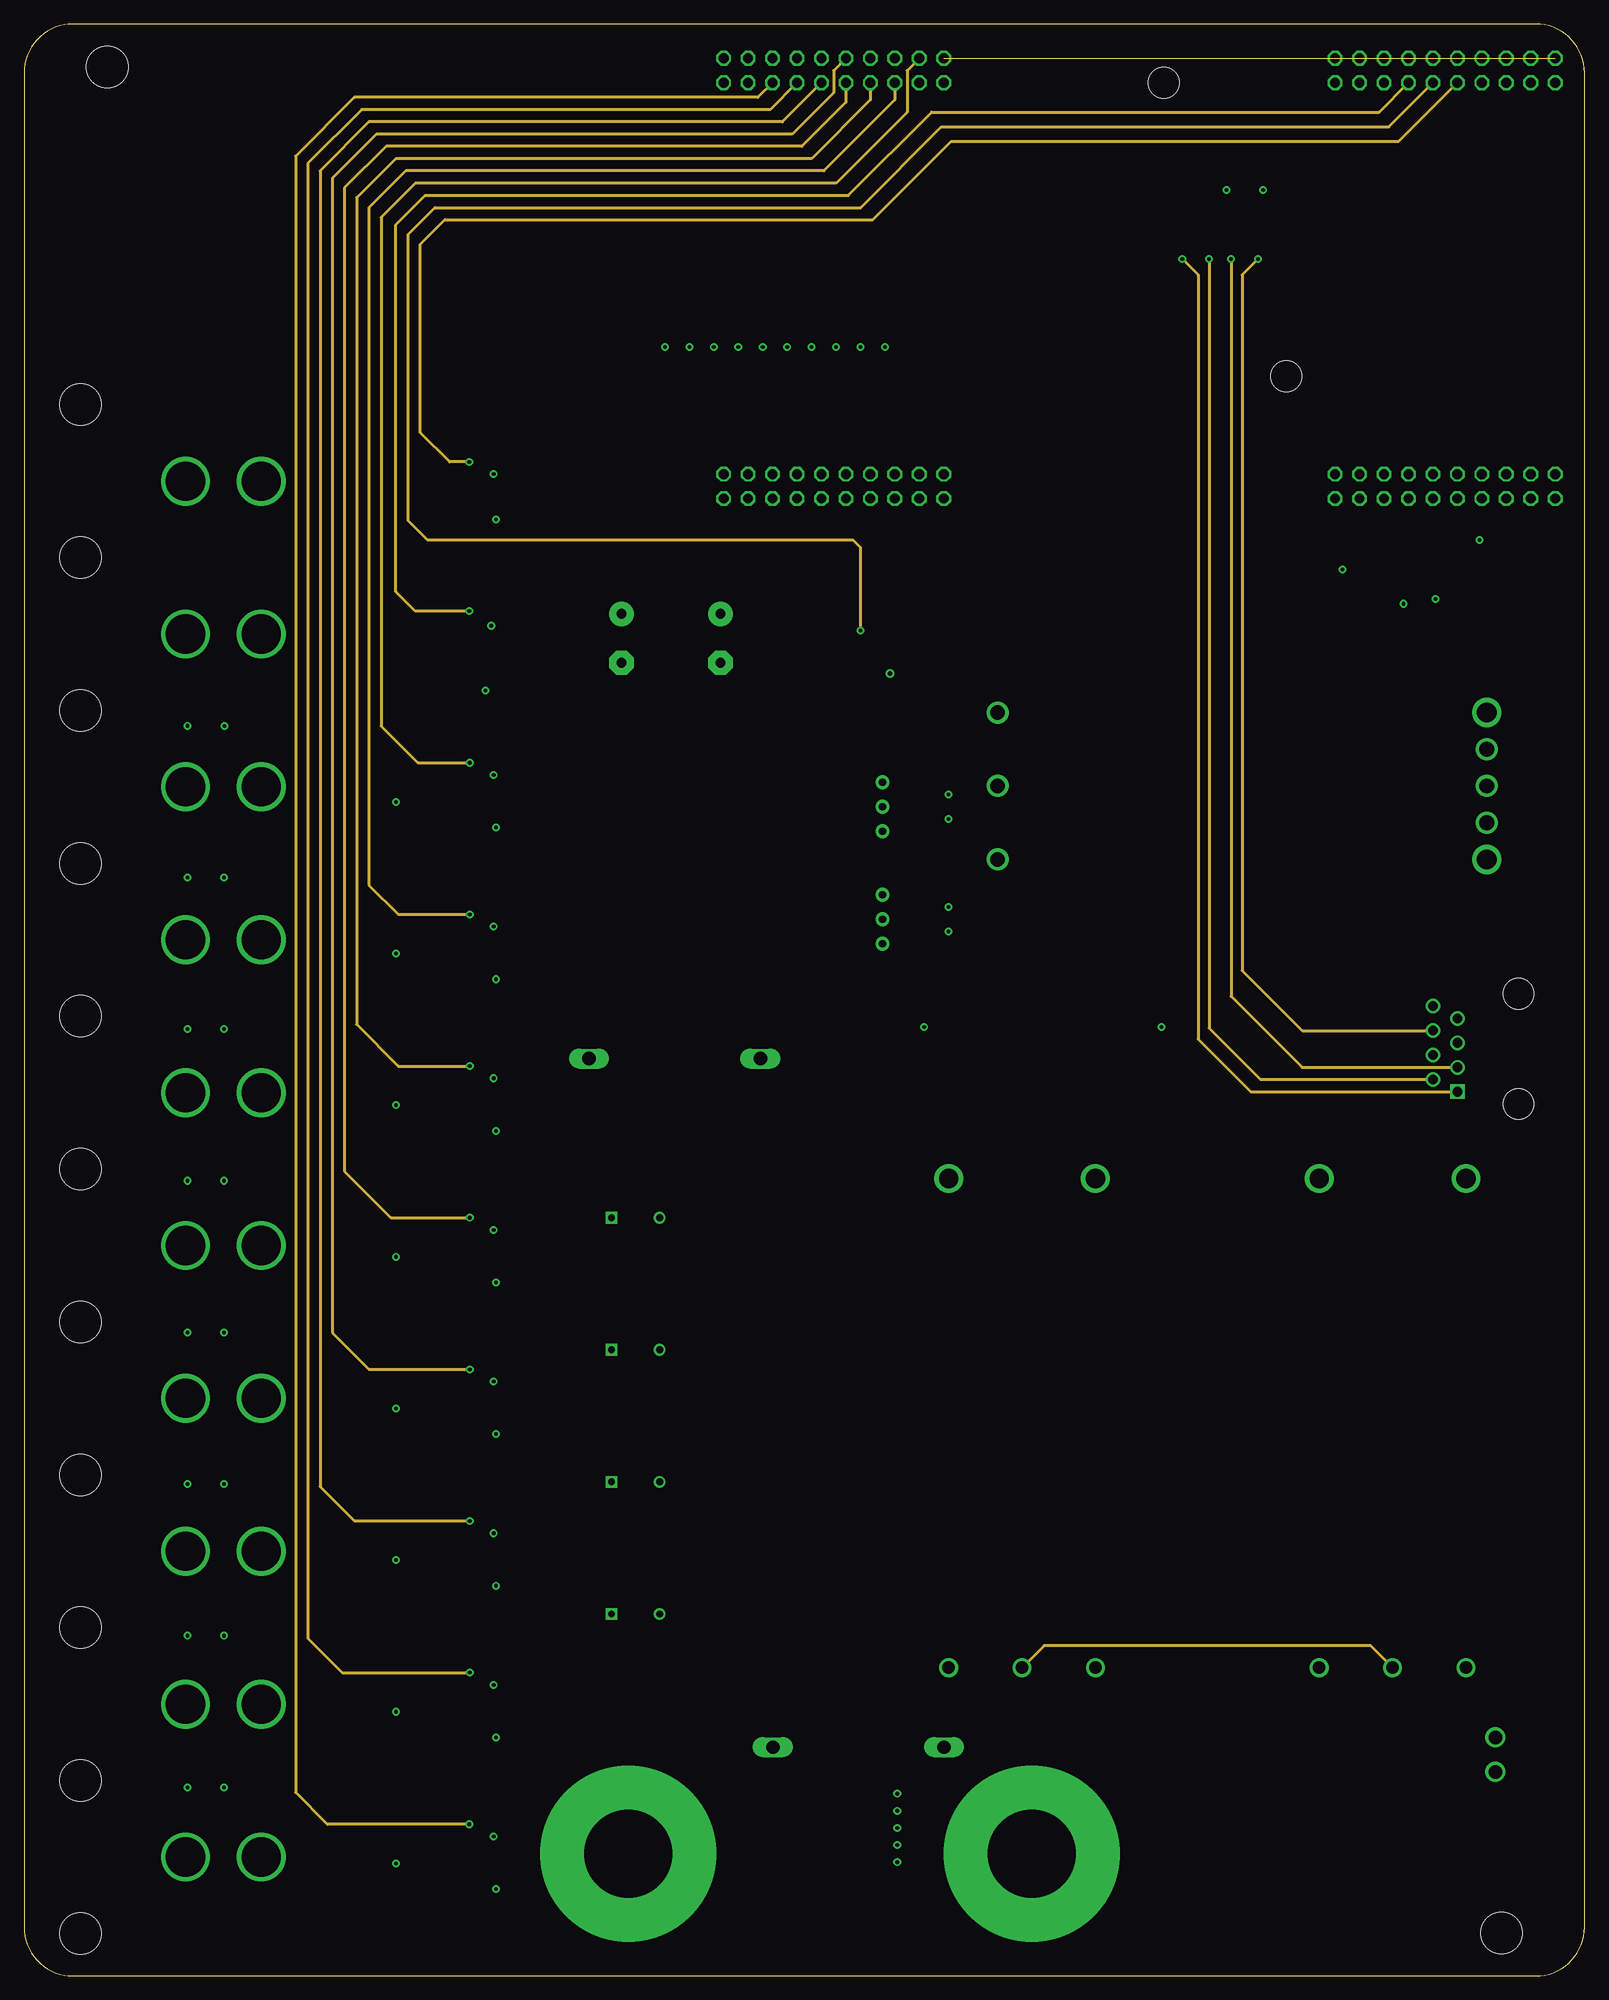
[diagram p5: board, inner layer Bot-Mid(Sig)]
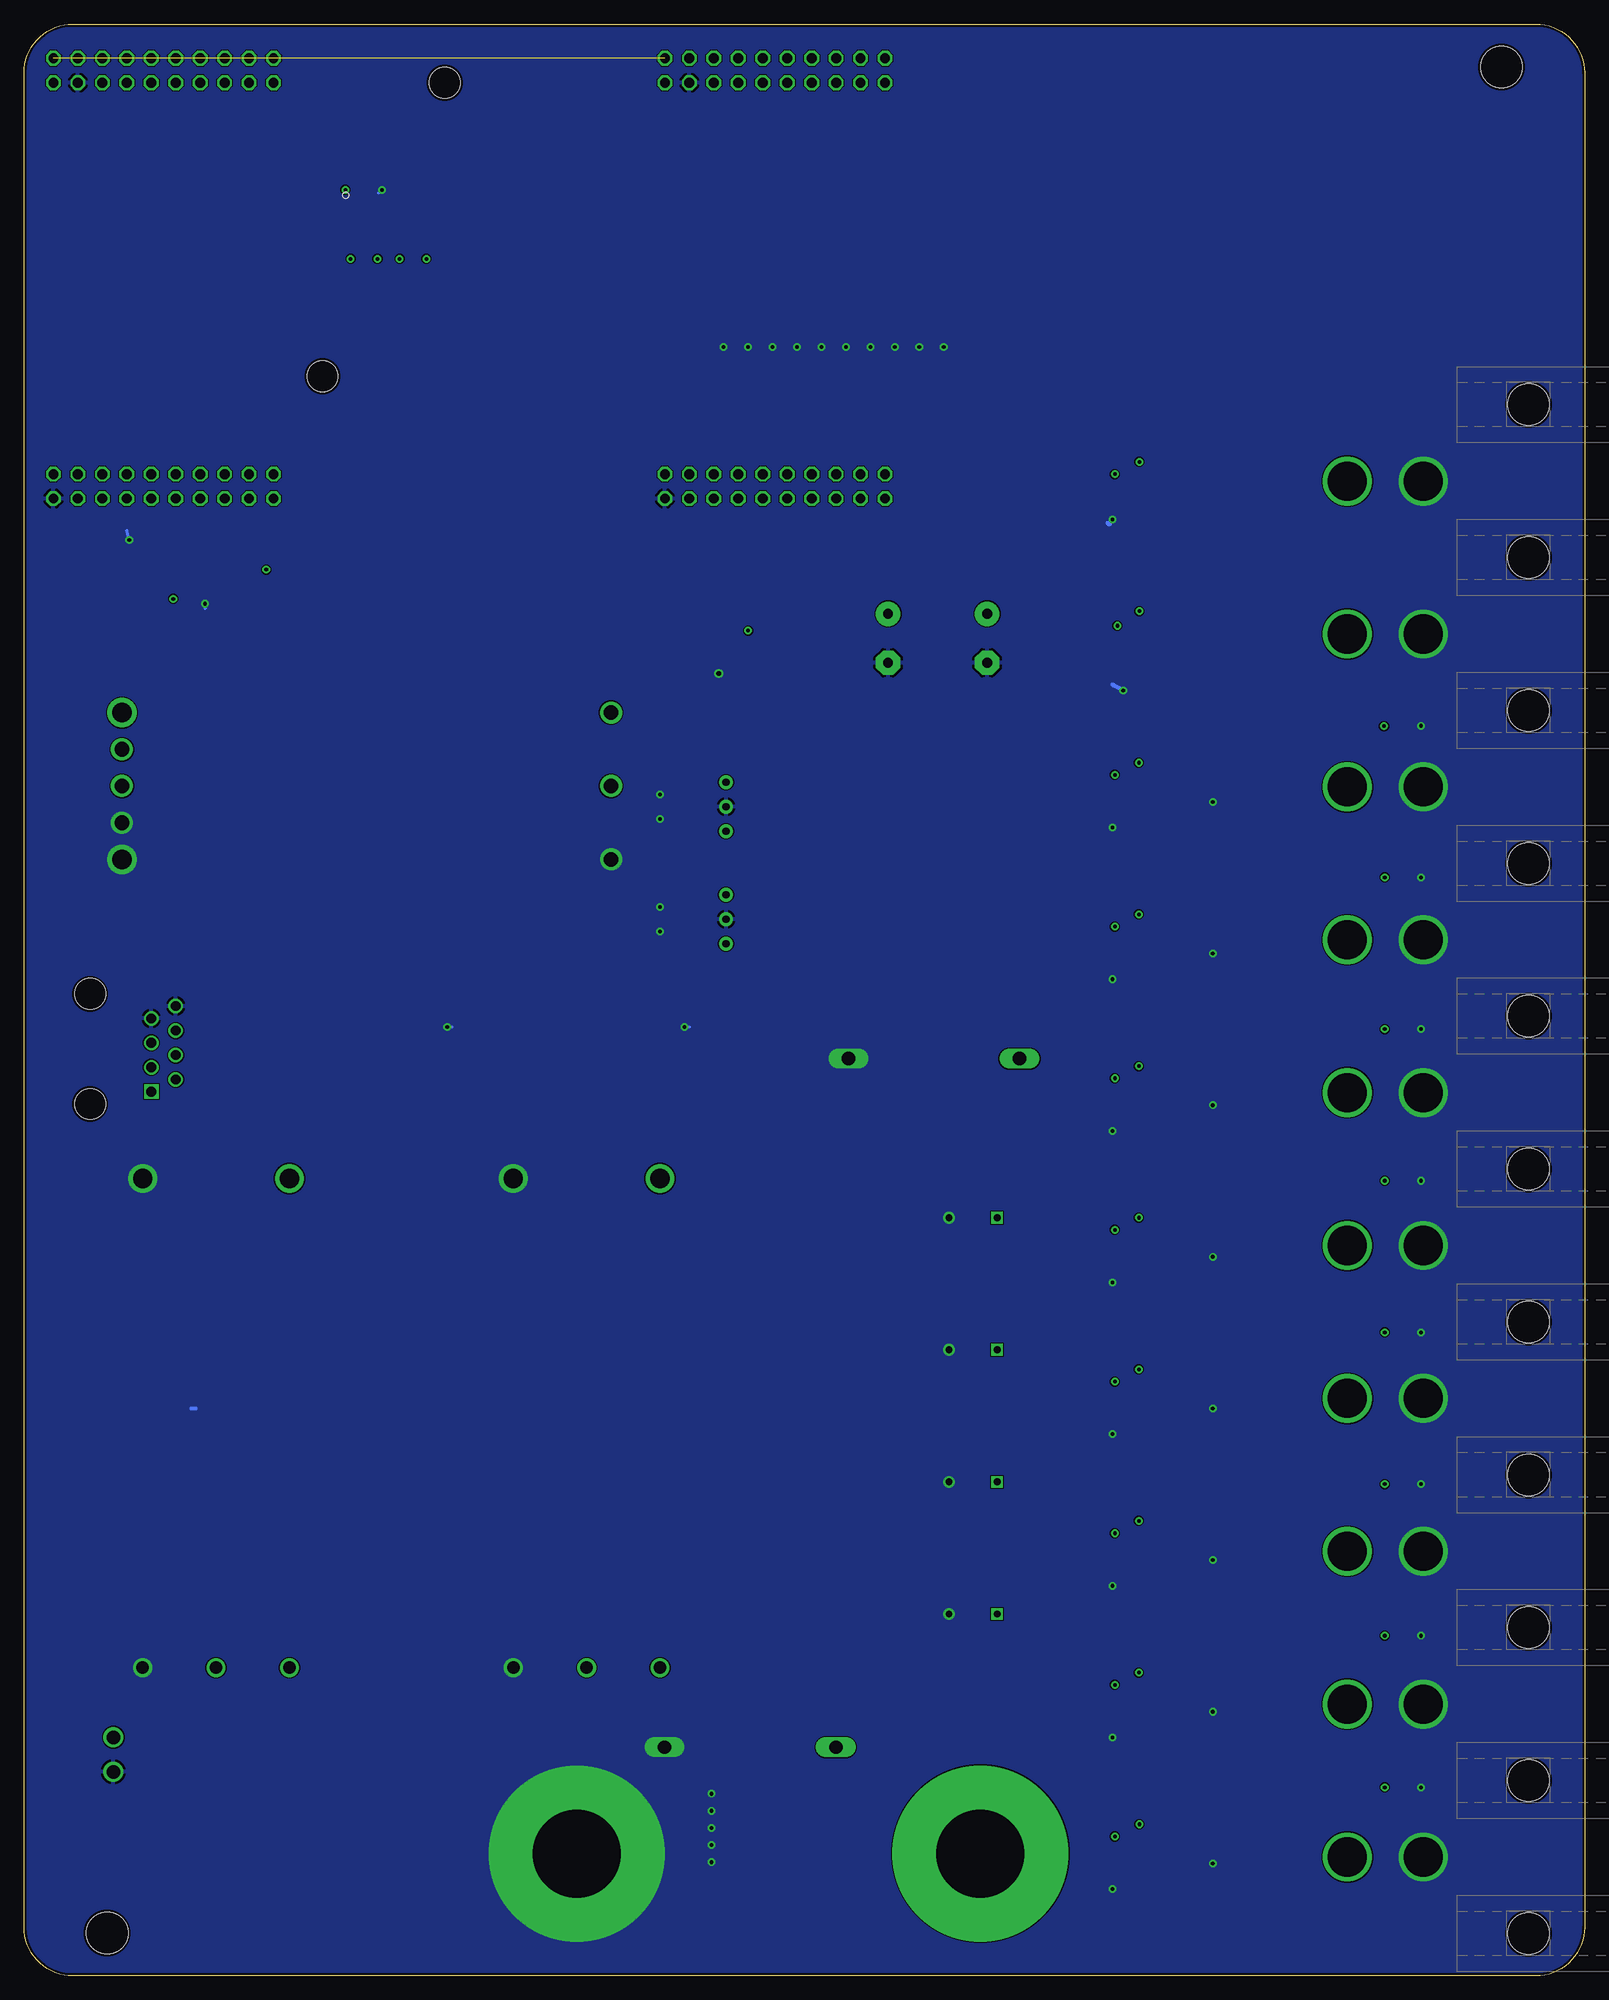
[diagram p6: board, bottom side, seen from below]

Size 162.05 x 202.69 mm. Coordinates in mm from the lower left corner, seen from the top.
Outline: 5.08,0 156.97,0 arc90 162.05,5.08 162.05,197.61 arc90 156.97,202.69 5.08,202.69 arc90 0,197.61 0,5.08 arc90 5.08,0
Copper layers (1*2*15*16): Top 0.035559375mm / dielectric 1.501140625mm / Top-Mid(3.3) 0.035559375mm / dielectric 0.149859375mm / Bot-Mid(Sig) 0.035559375mm / dielectric 0.200659375mm / Bottom(GND) 0.035559375mm
Design rules "typical_4pcb *": minimum track width 6mil, minimum drill 10mil, track to track 5mil, track to pad 5mil, pad to pad 5mil, via to via 5mil, smd to smd 5mil, copper to edge 10mil, drill to drill 8mil, minimum pad ring 10mil, minimum via ring 8mil, stop-mask expansion 4mil, vias tented up to drill 0mil, thermal gap 10mil
Holes 3.2 mm at 118.36,196.6 131.06,166.12

### Footprints (pad centres in the part's own frame; a part is rotated, then mirrored left to right if it is on the bottom)
691322110002 = drill 1.4: L -1.79,0; R 1.79,0
SOIC8_ACS711 = smd 1.92 x 2.2: 1 -1.27,-2.6; 4 1.27,-2.6 | smd 0.6 x 2.2: 5 1.905,2.6; 6 0.635,2.6; 7 -0.635,2.6; 8 -1.905,2.6
C1206 = smd 1.6 x 1.8: 1 -1.4,0; 2 1.4,0
LARGE_TERMINAL_HOLE = drill 9.144 pad 18.288: P$1 0,0
OKI-78SR_HORIZ = drill 0.762 pad 1.422: 1 0,0; 2 -2.54,0; 3 -5.08,0
APP45_PCB_HORIZ_RIGHT = drill 4.064: P$1 28.194,3.969
C_12.5MM = drill 0.7 square: + -2.5,0 | drill 0.7: - 2.5,0
E5-8,5 = drill 1.016 pad 2.54: + -2.54,0 | drill 1.016 pad 2.54 octagon: - 2.54,0
CB429-17 = drill 1.397 long: A 8.89,0; C -8.89,0
D2PACK = smd 2.083 x 3.81: 1 2.54,-4.191; 2 7.62,-4.191 | smd 10.16 x 7.62: TAB 5.08,6.604
U-T48-QB-NO_TRIM = drill 1.3: 1 -25.4,7.62; 2 -25.4,0; 3 -25.4,-7.62 | drill 2: 4 25.4,-7.62; 8 25.4,7.62
LED-1206 = smd 1.2 x 1.4: A -1.5,0; C 1.5,0
1206 = smd 1.6 x 1.8: 1 -1.4,0; 2 1.4,0
SO8 = smd 0.6 x 2.2: 1 -1.905,-2.6; 2 -0.635,-2.6; 3 0.635,-2.6; 4 1.905,-2.6; 5 1.905,2.6; 6 0.635,2.6; 7 -0.635,2.6; 8 -1.905,2.6
DPAK = smd 1.6 x 3: 1 -2.28,-5.31; 3 2.28,-5.31 | smd 4.826 x 5.715: 4 0,1.588
SOT23-3 = smd 0.8 x 0.9: 1 -0.95,-1; 2 0.95,-1; 3 0,1.1
SOT323 = smd 0.7 x 0.7: 1 -0.65,-0.925; 2 0.65,-0.925; 3 0,0.925
R1206 = smd 1.6 x 1.803: 1 -1.422,0; 2 1.422,0
APP45_PCB_HORIZ_RIGHT_2HIGH = drill 4.064: P$2 36.068,3.969
TIVA-C-CONNECTED = drill 1.016 octagon: +3V3_1 59.69,54.61; +3V3_2 123.19,54.61; +5V_1 59.69,52.07; +5V_2 123.19,52.07; GND_1 57.15,52.07; GND_2 59.69,8.89; GND_3 120.65,52.07; GND_4 123.19,8.89; PA4 39.37,52.07; PA5 36.83,52.07; PA6 105.41,52.07; PA7 52.07,8.89; PB2 102.87,54.61; PB3 100.33,54.61; PB4 54.61,52.07; PB5 52.07,52.07; PC4 118.11,54.61; PC5 115.57,54.61; PC6 113.03,54.61; PC7 105.41,54.61; PD0 107.95,8.89; PD1 110.49,8.89; PD2 57.15,54.61; PD3 107.95,54.61; PD4 49.53,54.61; PD5 46.99,54.61; PD7 107.95,52.07; PE0 118.11,52.07; PE1 115.57,52.07; PE2 113.03,52.07; PE3 110.49,52.07; PE4 120.65,54.61; PE5 110.49,54.61; PF1 123.19,11.43; PF2 120.65,11.43; PF3 118.11,11.43; PG0 115.57,11.43; PG1 59.69,11.43; PH0 44.45,11.43; PH1 41.91,11.43; PH2 118.11,8.89; PH3 115.57,8.89; PK0 49.53,52.07; PK1 46.99,52.07; PK2 44.45,52.07; PK3 41.91,52.07; PK4 57.15,11.43; PK5 54.61,11.43; PK6 39.37,11.43; PK7 36.83,11.43; PL0 107.95,11.43; PL1 105.41,11.43; PL2 102.87,11.43; PL3 100.33,11.43; PL4 113.03,11.43; PL5 110.49,11.43; PM0 52.07,11.43; PM1 49.53,11.43; PM2 46.99,11.43; PM3 120.65,8.89; PM4 102.87,52.07; PM5 100.33,52.07; PM6 36.83,8.89; PM7 57.15,8.89; PN2 105.41,8.89; PN3 102.87,8.89; PN4 36.83,54.61; PN5 39.37,54.61; PP0 54.61,54.61; PP1 52.07,54.61; PP2 100.33,8.89; PP3 41.91,8.89; PP4 41.91,54.61; PP5 54.61,8.89; PQ0 44.45,54.61; PQ1 39.37,8.89; PQ2/PA3 46.99,8.89; PQ3/PA2 44.45,8.89; RST1 49.53,8.89; RST_2 113.03,8.89
APP45_MOUNTING_WING_HORIZ = hole 4.318: -7.366,3.969
FCI-54602-908LF = drill 1 square: 1 -4.445,6.35 | drill 1: 2 -3.175,8.89; 3 -1.905,6.35; 4 -0.635,8.89; 5 0.635,6.35; 6 1.905,8.89; 7 3.175,6.35; 8 4.445,8.89 | hole 3.2: -5.715,0; 5.715,0
LM5050 = smd 0.6 x 1.1: P$1 0,-1.35; P$2 0,1.35; P$3 0.95,-1.35; P$4 -0.95,-1.35; P$5 -0.95,1.35; P$6 0.95,1.35
MURATA_5V_DC-DC_CONVERTER = drill 1.524: P$1 -24.13,-0.635; P$2 -24.13,6.985; P$3 -24.13,-8.255; P$4 26.67,-0.635; P$7 26.67,-4.445; P$8 26.67,3.175 | drill 2.032: P$5 26.67,6.985; P$6 26.67,-8.255
#8_SCREW = hole 4.318: 0,0
MAX3070E = smd 0.49 x 1.3: A -1.905,2.857; B -0.635,2.857; DI 0.635,-2.857; GND 1.905,-2.857; RO -0.635,-2.857; VCC -1.905,-2.857; Y 1.905,2.857; Z 0.635,2.857

### Placement (x,y rotation side)
5V-INT  H_WR-TBL_321*0002HORIZ  [691322110002]  152.78,22.99 90 top
ACS714-M1  45.63,16.79 180 top
ACS714-M2  45.63,32.54 180 top
ACS714-M3  45.63,48.29 180 top
ACS714-M4  45.63,64.04 180 top
ACS714-M5  45.63,79.78 180 top
ACS714-M6  45.63,95.53 180 top
ACS714-M7  45.63,111.28 180 top
ACS714-M8  45.63,127.03 180 top
ACS714CAP-M1  47.55,10.44 90 top
ACS714CAP-M2  47.55,26.19 90 top
ACS714CAP-M3  47.55,41.94 90 top
ACS714CAP-M4  47.55,57.69 90 top
ACS714CAP-M5  47.55,73.43 90 top
ACS714CAP-M6  47.55,89.18 90 top
ACS714CAP-M7  47.55,104.93 90 top
ACS714CAP-M8  47.55,120.68 90 top
BATT-NEG  104.65,12.7 0 top
BATT-POS  62.74,12.7 0 top
BB-8-5V  89.15,112.27 90 top
BB-8-5V1  89.15,123.95 90 top
BOTAPP-M1  -11.43,8.38 0 top
BOTAPP-M2  -11.43,24.26 0 top
BOTAPP-M3  -11.43,40.13 0 top
BOTAPP-M4  -11.43,56.01 0 top
BOTAPP-M5  -11.43,71.88 0 top
BOTAPP-M6  -11.43,87.76 0 top
BOTAPP-M7  -11.43,103.63 0 top
BOTAPP-M8  -11.43,119.51 0 top
C1  63.5,65.02 0 top
C2  63.5,51.31 0 top
C3  63.5,37.59 0 top
C4  63.5,78.74 0 top
C5  93.98,123.95 0 top
C6  47.49,136.4 90 top
C7  93.98,118.87 0 top
C8  93.98,121.41 0 top
C11  47.5,152.15 90 top
C12  45.21,152.15 270 top
C13  89.41,166.12 90 top
C14  71.63,166.12 90 top
C15  81.79,166.12 90 top
C17  84.33,166.12 90 top
C18  87.88,11.81 0 top
C19  103.63,88.39 0 top
C20  142.09,88.38 0 top
C21  87.88,18.92 0 top
C22  87.88,15.37 0 top
C34  76.71,166.12 90 top
C43  45.21,136.4 270 top
C44  66.55,166.12 90 top
C45  72.33,138.91 270 top
C46  62.04,138.91 270 top
C47  93.98,112.27 0 top
C48  93.98,107.19 0 top
C49  93.98,109.73 0 top
C50  79.25,166.12 90 top
C51  74.17,166.12 90 top
C52  69.09,166.12 90 top
C53  86.87,166.12 90 top
D1  67.56,95.25 0 top
D2  86.65,23.75 0 top
FET-M1  29.97,24.38 270 top
FET-M2  29.97,40.13 270 top
FET-M3  29.97,55.88 270 top
FET-M4  29.97,71.63 270 top
FET-M5  29.97,87.38 270 top
FET-M6  29.97,103.38 270 top
FET-M7  29.97,119.13 270 top
FET-M8  29.97,135.13 270 top
FILTERCAP-M1  45.23,10.44 270 top
FILTERCAP-M2  45.23,26.19 270 top
FILTERCAP-M3  45.23,41.94 270 top
FILTERCAP-M4  45.23,57.69 270 top
FILTERCAP-M5  45.23,73.43 270 top
FILTERCAP-M6  45.23,89.18 270 top
FILTERCAP-M7  45.23,104.93 270 top
FILTERCAP-M8  45.23,120.68 270 top
FINN-12V  142.11,57.4 90 top
LED2  17.27,143.51 180 top
LED3  17.27,159.26 180 top
LED5  158.37,17.14 180 top
LED-M1  35.56,11.68 0 top
LED-M2  35.56,27.43 0 top
LED-M3  35.56,43.18 0 top
LED-M4  35.56,58.93 0 top
LED-M5  35.56,74.68 0 top
LED-M6  35.56,90.42 0 top
LED-M7  35.56,106.17 0 top
LED-M8  35.56,121.92 0 top
LEDRES-M1  30.23,11.68 0 top
LEDRES-M2  30.23,27.43 0 top
LEDRES-M3  30.23,43.18 0 top
LEDRES-M4  30.23,58.93 0 top
LEDRES-M5  30.23,74.68 0 top
LEDRES-M6  30.23,90.42 0 top
LEDRES-M7  30.23,106.17 0 top
LEDRES-M8  30.23,121.92 0 top
LT1910-M1  18.85,20.02 0 top
LT1910-M2  18.85,35.76 0 top
LT1910-M3  18.85,51.51 0 top
LT1910-M4  18.85,67.26 0 top
LT1910-M5  18.85,83.01 0 top
LT1910-M6  18.85,98.76 0 top
LT1910-M7  18.85,114.5 0 top
LT1910-M8  18.85,130.25 0 top
LT1910CAP-M1  14.99,20.07 90 top
LT1910CAP-M2  14.99,35.81 90 top
LT1910CAP-M3  14.99,51.56 90 top
LT1910CAP-M4  14.99,67.31 90 top
LT1910CAP-M5  14.99,83.06 90 top
LT1910CAP-M6  14.99,98.81 90 top
LT1910CAP-M7  14.99,114.55 90 top
LT1910CAP-M8  14.99,130.3 90 top
POE-12V  103.63,57.4 90 top
Q1  106.17,97.92 270 top
Q2  145.54,147.57 270 top
Q3  130.56,97.92 270 top
Q4  145.54,144.27 270 top
Q12  150.52,147.62 270 top
R1  140.21,148.34 180 top
R2  121.67,178.31 0 top
R3  85.6,136.65 270 top
R4  88.14,136.65 90 top
R5  146.3,150.62 0 top
R6  140.21,143.76 0 top
R7  126.75,178.31 180 top
R8  22.78,159.28 180 top
R10  22.94,143.51 180 top
R11  140.21,146.05 180 top
R13  152.91,17.14 180 top
R15  140.17,150.65 180 top
TOPAPP-M1  -11.43,8.38 0 top
TOPAPP-M2  -11.43,24.26 0 top
TOPAPP-M3  -11.43,40.13 0 top
TOPAPP-M4  -11.43,56.01 0 top
TOPAPP-M5  -11.43,71.88 0 top
TOPAPP-M6  -11.43,87.76 0 top
TOPAPP-M7  -11.43,103.63 0 top
TOPAPP-M8  -11.43,119.51 0 top
U$1  35.81,144.53 0 top
U$2  13.21,119.51 180 bottom
U$3  45.62,158.5 180 top
U$4  13.21,135.38 180 bottom
U$5  155.19,96.27 90 top
U$6  120.65,98.55 270 top
U$7  125.22,124.21 0 top
U$8  153.42,4.45 0 top
U$9  96.01,98.55 270 top
U$10  8.64,198.25 0 top
U$21  45.62,142.8 180 top
U$22  [MRDT_LOGO]  117.6,15.24 0 top
U$24  126.75,183.64 180 top
U$25  13.21,167.13 180 bottom
U$26  -11.43,135.38 0 top
U$27  -11.43,151.26 0 top
U$28  -11.43,151.26 0 top
U$29  -11.43,135.38 0 top
U$30  13.21,56.01 180 bottom
U$31  13.21,40.13 180 bottom
U$32  13.21,103.63 180 bottom
U$33  13.21,8.38 180 bottom
U$34  13.21,24.26 180 bottom
U$35  13.21,87.76 180 bottom
U$41  13.21,151.26 180 bottom
U$42  13.21,71.88 180 bottom

### Tracks (layer width: path | path; a pad name or v marks a point on that pad's centre or on a via)
3.3V  (via drill 0.38)
  Top 0.305: ACS714-M1.8 47.43,14.48 v48.77,14.48 | ACS714-M2.8 47.43,30.23 v48.77,30.23 | ACS714-M3.8 47.43,45.97 v48.77,45.97 | ACS714-M4.8 47.43,61.72 v48.77,61.72 | ACS714-M5.8 47.43,77.47 v48.77,77.47 | ACS714-M6.8 47.43,93.22 v48.77,93.22 | ACS714-M7.8 47.43,108.97 v48.77,108.97 | ACS714-M8.8 47.43,124.71 v48.77,124.71 | U$24.VCC 128.65,185.5 v128.68,185.47
  Top 0.406: ACS714-M1.8 47.54,11.86 ACS714CAP-M1.2 | ACS714-M2.8 47.54,27.61 ACS714CAP-M2.2 | ACS714-M3.8 47.54,43.35 ACS714CAP-M3.2 | ACS714-M4.8 ACS714CAP-M4.2 | ACS714-M5.8 47.54,74.85 ACS714CAP-M5.2 | ACS714-M6.8 47.54,90.6 ACS714CAP-M6.2 | ACS714-M7.8 47.54,106.34 ACS714CAP-M7.2 | ACS714-M8.8 47.54,122.09 ACS714CAP-M8.2 | 47.52,137.84 U$21.8 47.79,140.21 v48.51,140.21 | U$3.8 47.52,153.57 C11.2 47.5,155.96 v48.77,155.96
  Top 0.508: 47.52,137.84 C6.2
  Top-Mid(3.3) 0.305: v128.68,185.47 128.7,184.96 128.65,184.91
  Top-Mid(3.3) 0.406: v48.77,155.96 49.53,155.96
  pour Top-Mid(3.3) (isolate 0.127, rank 2): -20.07,207.77 167.64,207.77 167.64,-11.68 -20.07,-11.68
  pour Top (isolate 0.127, no thermals): 88.14,107.7 88.14,106.68 88.65,106.17 93.22,106.17 93.47,106.43 93.47,113.03 93.22,113.28 91.95,113.28 91.69,113.03 91.69,108.46 91.44,108.2 88.65,108.2
5V
  Top 0.305: LED5.A 159.87,17.69 5V-INT.R
  Top-Mid(3.3) 0.762: 160.78,183.64 160.78,29.86 155.7,24.78 5V-INT.R | 160.78,183.64 160.78,194.82 U$1.+5V_2 | 98.81,183.64 160.78,183.64 | 98.81,183.64 98.81,120.65 97.03,118.87 BB-8-5V1.3 | U$1.+5V_1 98.81,193.29 98.81,183.64
  pour Top (isolate 0.127, no thermals): 88.14,119.38 88.14,118.36 88.65,117.86 93.22,117.86 93.47,118.11 93.47,124.71 93.22,124.97 91.95,124.97 91.69,124.71 91.69,120.14 91.44,119.89 88.65,119.89
5V-AUX
  pour Top (isolate 0.127, no thermals): 33.27,158.24 43.74,158.24 45.06,159.56 45.06,162.26 41.96,165.35 30.23,165.35 21.34,156.46 21.34,152.4 22.61,151.13 26.16,151.13
12V-AUX
  pour Top (isolate 0.127, no thermals): 30.48,139.7 40.49,139.7 45.06,144.27 45.06,146.46 40.39,151.13 31.75,151.13 21.34,140.72 21.34,136.91 23.11,135.38 26.16,135.38
DRAIN-M1
  Top 0.406: FET-M1.TAB 23.11,19.3 21.48,20.94 19.47,20.94 | 19.47,20.94 16.93,20.94 | 16.93,20.94 15.24,20.94 14.99,21.08 LT1910CAP-M1.2 | LT1910-M1.8 16.93,22.54 16.93,20.94 | LT1910-M1.6 19.47,22.54 19.47,20.94
  pour Top (isolate 0.127, no thermals): 30.73,25.4 30.73,13.21 41.79,13.21 42.67,14.22 42.67,16 44.45,16 45.14,16.69 45.14,21.16 41.15,25.4
DRAIN-M2
  Top 0.406: FET-M2.TAB 23.11,35.05 21.48,36.69 19.47,36.69 | 19.47,36.69 16.93,36.69 | 16.93,36.69 15.24,36.69 14.99,36.83 LT1910CAP-M2.2 | LT1910-M2.8 16.93,38.29 16.93,36.69 | LT1910-M2.6 19.47,38.29 19.47,36.69
  pour Top (isolate 0.127, no thermals): 30.73,41.15 30.73,28.96 41.79,28.96 42.67,29.97 42.67,31.75 44.45,31.75 45.14,32.44 45.14,36.91 41.15,41.15
DRAIN-M3
  Top 0.406: FET-M3.TAB 23.11,50.8 21.48,52.44 19.47,52.44 | 19.47,52.44 16.93,52.44 | 16.93,52.44 15.24,52.44 14.99,52.58 LT1910CAP-M3.2 | LT1910-M3.8 16.93,54.03 16.93,52.44 | LT1910-M3.6 19.47,54.03 19.47,52.44
  pour Top (isolate 0.127, no thermals): 30.73,56.9 30.73,44.7 41.79,44.7 42.67,45.72 42.67,47.5 44.45,47.5 45.14,48.18 45.14,52.65 41.15,56.9
DRAIN-M4
  Top 0.406: FET-M4.TAB 23.11,66.55 21.48,68.18 19.47,68.18 | 19.47,68.18 16.93,68.18 | 16.93,68.18 15.24,68.18 14.99,68.33 LT1910CAP-M4.2 | LT1910-M4.8 16.93,69.78 16.93,68.18 | LT1910-M4.6 19.47,69.78 19.47,68.18
  pour Top (isolate 0.127, no thermals): 30.73,72.64 30.73,60.45 41.79,60.45 42.67,61.47 42.67,63.25 44.45,63.25 45.14,63.93 45.14,68.4 41.15,72.64
DRAIN-M5
  Top 0.406: FET-M5.TAB 23.11,82.3 21.48,83.93 19.47,83.93 | 19.47,83.93 16.93,83.93 | 16.93,83.93 15.24,83.93 14.99,84.07 LT1910CAP-M5.2 | LT1910-M5.8 16.93,85.53 16.93,83.93 | LT1910-M5.6 19.47,85.53 19.47,83.93
  pour Top (isolate 0.127, no thermals): 30.73,88.39 30.73,76.2 41.79,76.2 42.67,77.22 42.67,78.99 44.45,78.99 45.14,79.68 45.14,84.15 41.15,88.39
DRAIN-M6
  Top 0.406: FET-M6.TAB 22.86,98.3 21.48,99.68 19.47,99.68 | 19.47,99.68 16.93,99.68 | 16.93,99.68 15.24,99.68 14.99,99.82 LT1910CAP-M6.2 | LT1910-M6.8 16.93,101.28 16.93,99.68 | LT1910-M6.6 19.47,101.28 19.47,99.68
  pour Top (isolate 0.127, no thermals): 30.73,104.14 30.73,91.95 41.79,91.95 42.67,92.96 42.67,94.74 44.45,94.74 45.14,95.43 45.14,99.9 41.15,104.14
DRAIN-M7
  Top 0.406: FET-M7.TAB 22.86,114.05 21.48,115.43 19.47,115.43 | 19.47,115.43 16.93,115.43 | 16.93,115.43 15.24,115.43 14.99,115.57 LT1910CAP-M7.2 | LT1910-M7.8 16.93,117.03 16.93,115.43 | LT1910-M7.6 19.47,117.03 19.47,115.43
  pour Top (isolate 0.127, no thermals): 30.73,119.89 30.73,107.7 41.79,107.7 42.67,108.71 42.67,110.49 44.45,110.49 45.14,111.18 45.14,115.65 41.15,119.89
DRAIN-M8
  Top 0.406: FET-M8.TAB 22.61,130.05 21.48,131.18 19.47,131.18 | 19.47,131.18 16.93,131.18 | 16.93,131.18 15.24,131.18 14.99,131.32 LT1910CAP-M8.2 | LT1910-M8.8 16.93,132.78 16.93,131.18 | LT1910-M8.6 19.47,132.78 19.47,131.18
  pour Top (isolate 0.127, no thermals): 30.73,135.64 30.73,123.44 41.79,123.44 42.67,124.46 42.67,126.24 44.45,126.24 45.14,126.92 45.14,131.39 41.15,135.64
FILTER-M1
  Top 0.406: ACS714-M1.6 45,12.08 FILTERCAP-M1.1
FILTER-M2
  Top 0.406: ACS714-M2.6 45,27.82 FILTERCAP-M2.1
FILTER-M3
  Top 0.406: ACS714-M3.6 45,43.57 FILTERCAP-M3.1
FILTER-M4
  Top 0.406: ACS714-M4.6 45,59.32 FILTERCAP-M4.1
FILTER-M5
  Top 0.406: ACS714-M5.6 45,75.07 FILTERCAP-M5.1
FILTER-M6
  Top 0.406: ACS714-M6.6 45,90.82 FILTERCAP-M6.1
FILTER-M7
  Top 0.406: ACS714-M7.6 45,106.56 FILTERCAP-M7.1
FILTER-M8
  Top 0.406: ACS714-M8.6 45,122.31 FILTERCAP-M8.1
GATE-M1
  Top 0.406: FET-M1.1 20.76,21.84 LT1910-M1.5
GATE-M2
  Top 0.406: FET-M2.1 20.76,37.59 LT1910-M2.5
GATE-M3
  Top 0.406: FET-M3.1 20.76,53.34 LT1910-M3.5
GATE-M4
  Top 0.406: FET-M4.1 20.76,69.09 LT1910-M4.5
GATE-M5
  Top 0.406: FET-M5.1 20.76,84.84 LT1910-M5.5
GATE-M6
  Top 0.406: FET-M6.1 20.76,100.84 LT1910-M6.5
GATE-M7
  Top 0.406: FET-M7.1 20.76,116.59 LT1910-M7.5
GATE-M8
  Top 0.406: FET-M8.1 21.02,132.59 LT1910-M8.5
GND  (via drill 0.38, 0.5)
  Top 0.305: U$24.GND 124.84,186.06 v124.87,185.47 | R4.1 89.81,135.23 v89.92,135.25 | 47.88,135 47.88,133.53 v47.9,133.5 | POE-12V.4 105.66,88.39 C19.2 | FINN-12V.4 144.16,88.38 C20.2 | R13.2 151.51,19.92 5V-INT.L | LED3.C 15.77,156.22 U$28.P$1 | LED2.C 15.77,140.34 U$29.P$1 | R6.2 142.05,143.32 Q4.2 | C11.1 47.5,150.88 47.75,151.13 48.92,151.13 v49.02,151.23 | U$9.P$1 v93.47,98.55 | U$6.P$1 v118.11,98.55 | R5.2 148.84,150.62 150.37,149.1 | 150.37,149.1 150.37,147.32 150.02,146.97 Q12.2 149.44,146.97 147.96,148.46 145.92,148.46 144.53,147.07 144.53,146.64 Q2.2 | Q4.2 144.53,143.34 | 150.37,149.1 v151.13,149.1 | Q4.2 143.26,143.32 v143.26,142.49
  Top 0.406: v49.02,9.02 v49.02,9.01 ACS714CAP-M1.1 FILTERCAP-M1.2 | ACS714-M1.5 43.73,10.29 FILTERCAP-M1.2 | LED-M1.C v38.61,11.68 | LT1910CAP-M1.1 15.69,18.67 LT1910-M1.1 16.98,17.45 v16.98,19.58 | v49.02,24.77 v49.02,24.76 ACS714CAP-M2.1 FILTERCAP-M2.2 | ACS714-M2.5 43.73,26.04 FILTERCAP-M2.2 | LED-M2.C v38.61,27.43 | LT1910CAP-M2.1 15.69,34.41 LT1910-M2.1 16.98,33.2 v16.98,35.33 | v49.02,40.51 ACS714CAP-M3.1 FILTERCAP-M3.2 | ACS714-M3.5 43.73,41.79 FILTERCAP-M3.2 | LED-M3.C v38.61,43.18 | LT1910CAP-M3.1 15.69,50.16 LT1910-M3.1 16.98,48.95 v16.98,51.08 | v49.02,56.26 ACS714CAP-M4.1 FILTERCAP-M4.2 | ACS714-M4.5 43.73,57.54 FILTERCAP-M4.2 | LED-M4.C v38.61,58.93 | LT1910CAP-M4.1 15.69,65.91 LT1910-M4.1 16.98,64.7 v16.98,66.83 | v49.02,72.01 ACS714CAP-M5.1 FILTERCAP-M5.2 | ACS714-M5.5 43.73,73.28 FILTERCAP-M5.2 | LED-M5.C v38.61,74.68 | LT1910CAP-M5.1 15.69,81.66 LT1910-M5.1 16.98,80.44 v16.98,82.58 | v49.02,87.76 v49.02,87.75 ACS714CAP-M6.1 FILTERCAP-M6.2 | ACS714-M6.5 43.73,89.03 FILTERCAP-M6.2 | LED-M6.C v38.61,90.42 | LT1910CAP-M6.1 15.69,97.41 LT1910-M6.1 16.98,96.19 v16.98,98.32 | v49.02,103.5 ACS714CAP-M7.1 FILTERCAP-M7.2 | ACS714-M7.5 43.73,104.78 FILTERCAP-M7.2 | LED-M7.C v38.61,106.17 | LT1910CAP-M7.1 15.69,113.15 LT1910-M7.1 16.98,111.94 v16.98,114.07 | v49.02,119.25 ACS714CAP-M8.1 FILTERCAP-M8.2 | ACS714-M8.5 43.73,120.53 FILTERCAP-M8.2 | LED-M8.C v38.61,121.92 | LT1910CAP-M8.1 15.69,128.9 LT1910-M8.1 16.98,127.69 v16.98,129.82 | FILTERCAP-M1.2 | FILTERCAP-M2.2 | FILTERCAP-M3.2 | FILTERCAP-M4.2 | FILTERCAP-M5.2 | FILTERCAP-M6.2 | FILTERCAP-M7.2 | FILTERCAP-M8.2 | U$21.5 43.71,136.5 C43.2 | U$3.5 43.71,152.25 C12.2 C11.1
  Top 0.406: C43.2 C6.1 | C43.2 47.88,135
  Bottom(GND) 0.305: v124.87,185.47 125.22,185.17 | v93.47,98.55 92.96,98.55 | v118.11,98.55 117.6,98.55 | v151.13,149.1 151.38,150.11 | v143.26,142.49 143.26,141.99
  Bottom(GND) 0.406: 144.65,58.93 144.27,58.93 | v47.9,133.5 48.92,134.01 49.02,134.11 | v49.02,151.23 49.38,150.72 49.53,150.88
  other vias: 90.68,11.81 90.68,13.59 90.68,15.37 90.68,17.14 90.68,18.92 66.55,169.16 69.09,169.16 71.63,169.16 74.17,169.16 76.71,169.16 79.25,169.16 81.79,169.16 84.33,169.16 86.87,169.16 89.41,169.16 96.01,111 96.01,108.46 96.01,122.68 96.01,120.14
  pour Bottom(GND) (isolate 0.127, rank 2): -0.51,-2.54 165.1,-2.54 165.1,205.74 -0.51,205.74
  pour Bottom(GND) (isolate 0.127, no thermals): 73.15,99.06 80.01,99.06 80.01,90.68 73.15,90.68
  pour Top (isolate 0.127, no thermals): 88.39,20.45 88.39,10.29 91.19,10.29 91.19,20.45
  pour Top (isolate 0.127): 65.53,169.67 65.53,166.62 90.42,166.62 90.42,169.67
  pour Top (isolate 0.127, no thermals): 94.74,113.28 94.49,113.03 94.49,106.43 94.74,106.17 96.27,106.17 96.52,106.43 96.52,113.03 96.27,113.28
  pour Top (isolate 0.127, no thermals): 94.74,124.97 94.49,124.71 94.49,118.11 94.74,117.86 96.27,117.86 96.52,118.11 96.52,124.71 96.27,124.97
  pour Bottom(GND) (isolate 0.127, no thermals): 64.52,79.76 64.52,35.56 67.56,35.56 67.56,79.76
  pour Bottom(GND) (isolate 0.127, no thermals): 92.71,25.91 92.71,21.34 98.04,21.34 98.04,25.91
IMEAS-5V  (via drill 0.38)
  Top 0.305: U$3.7 46.25,154.97 v46.23,157.23
  Bot-Mid(Sig) 0.305: v46.23,157.23 44.2,157.23 41.15,160.27 41.15,179.83 43.69,182.37 88.14,182.37 96.27,190.5 142.75,190.5 U$1.PE2
IMEAS-12V  (via drill 0.38)
  Top 0.305: U$21.7 46.25,141.71 v46.23,141.73
  Bot-Mid(Sig) 0.305: v46.23,141.73 40.64,141.73 38.61,143.76 38.61,181.86 41.66,184.91 85.6,184.91 94.23,193.55 140.72,193.55 U$1.PD7
IMEAS-M1  (via drill 0.38)
  Top 0.305: ACS714-M1.7 46.27,15.71 v46.23,15.75
  Top 0.406: 46.28,15.75 46.27,15.74 ACS714-M1.7
  Bot-Mid(Sig) 0.305: U$1.PK3 76.2,195.07 34.29,195.07 28.19,188.98 28.19,19.05 31.5,15.75 v46.23,15.75
IMEAS-M2  (via drill 0.38)
  Top 0.406: v46.28,31.5 46.27,31.23 ACS714-M2.7
  Bot-Mid(Sig) 0.305: U$1.PK2 77.47,193.8 35.05,193.8 29.46,188.21 29.46,35.05 33.02,31.5 v46.28,31.5
IMEAS-M3  (via drill 0.38)
  Top 0.406: v46.28,47.24 46.27,47.23 ACS714-M3.7
  Bot-Mid(Sig) 0.305: U$1.PK1 78.74,192.53 35.81,192.53 30.73,187.45 30.73,50.8 34.29,47.24 v46.28,47.24
IMEAS-M4  (via drill 0.38)
  Top 0.406: v46.28,62.99 46.27,62.73 ACS714-M4.7
  Bot-Mid(Sig) 0.305: U$1.PD4 84.07,197.87 84.07,195.58 79.76,191.26 36.58,191.26 32,186.69 32,66.8 35.81,62.99 v46.28,62.99
IMEAS-M5  (via drill 0.38)
  Top 0.406: v46.28,78.74 46.27,78.48 ACS714-M5.7
  Bot-Mid(Sig) 0.305: U$1.PK0 85.34,194.56 80.77,189.99 37.59,189.99 33.27,185.67 33.27,83.57 38.1,78.74 v46.28,78.74
IMEAS-M6  (via drill 0.38)
  Top 0.406: v46.28,94.49 46.27,94.22 ACS714-M6.7
  Bot-Mid(Sig) 0.305: U$1.PB5 87.88,194.82 81.79,188.72 38.61,188.72 34.54,184.66 34.54,98.81 38.86,94.49 v46.28,94.49
IMEAS-M7  (via drill 0.38)
  Top 0.406: v46.28,110.24 46.27,110.23 ACS714-M7.7
  Bot-Mid(Sig) 0.305: U$1.PB4 90.42,194.82 83.06,187.45 39.62,187.45 35.81,183.64 35.81,113.28 38.86,110.24 v46.28,110.24
IMEAS-M8  (via drill 0.38)
  Top 0.406: v46.28,125.98 46.27,125.72 ACS714-M8.7
  Bot-Mid(Sig) 0.305: U$1.PD2 91.69,197.87 91.69,193.55 84.33,186.18 40.64,186.18 37.08,182.63 37.08,129.79 40.89,125.98 v46.28,125.98
LEDLINE-M1
  Top 0.406: LEDRES-M1.2 LED-M1.A
LEDLINE-M2
  Top 0.406: LEDRES-M2.2 LED-M2.A
LEDLINE-M3
  Top 0.406: LEDRES-M3.2 LED-M3.A
LEDLINE-M4
  Top 0.406: LEDRES-M4.2 LED-M4.A
LEDLINE-M5
  Top 0.406: LEDRES-M5.2 LED-M5.A
LEDLINE-M6
  Top 0.406: LEDRES-M6.2 LED-M6.A
LEDLINE-M7
  Top 0.406: LEDRES-M7.2 LED-M7.A
LEDLINE-M8
  Top 0.406: LEDRES-M8.2 LED-M8.A
N$1
  Top 0.305: FINN-12V.8 140.07,88.38 C20.1 | U$6.P$6 123.63,97.6 124.97,96.27 124.97,95.92 Q3.3
  pour Top (isolate 0.127, no thermals): 126.75,80.26 135.89,80.26 136.91,81.28 136.91,84.33 135.89,85.34 129.29,85.34 127.51,87.12 127.51,95.76 126.75,96.52 123.44,96.52 122.68,95.76 122.68,84.33
N$2
  Top 0.305: 101.6,88.39 C19.1 | U$9.P$6 99.15,97.6 100.61,96.14 Q1.3
  pour Top (isolate 0.127, no thermals): 95,80.26 97.28,80.26 103.12,86.11 103.12,95.76 102.36,96.52 99.06,96.52 98.3,95.76 98.3,89.15 93.47,84.33 93.47,81.79
N$3
  Top 0.305: U$6.P$2 123.6,98.55 Q3.1
N$4
  Top 0.305: Q12.3 158.95,147.62 160.78,145.8 160.78,32.77 156.97,28.96 145.16,28.96 FINN-12V.2
  Bot-Mid(Sig) 0.305: FINN-12V.2 139.83,34.29 105.92,34.29 POE-12V.2
N$5
  Top 0.305: U$9.P$2 99.22,98.55 Q1.1
N$6
  Top 0.305: R13.1 LED5.C
N$11  (via drill 0.38)
  Top 0.305: Q4.3 146.56,144.19 v146.56,143
  Top-Mid(3.3) 0.305: U$7.P$1 127.13,123.57 v146.56,143
N$12
  Top 0.406: U$21.6 44.98,138.03
  Top 0.508: 44.98,138.03 C43.1
N$14
  Top 0.305: Q2.1 144.35,148.34 R1.1 140.21,146.94 140.21,144.78 139.19,143.76 R6.1
N$15
  Top 0.305: R11.1 141.99,146.05 142.81,145.22 Q4.1 146.64,147.32 Q2.3
N$33
  Top 0.305: U$9.P$4 U$9.P$5 97.36,100.92 98.55,102.11 105.66,102.11 107.7,100.08 107.7,97.98 Q1.4 | 122.17,102.36 122.17,99.68 U$6.P$5 U$6.P$4
  pour Top (isolate 0.127, rank 3, no thermals): 50.8,139.7 98.42,139.7 104.78,133.35 104.78,93.22 116.59,93.22 116.59,101.85 128.65,101.85 128.65,93.22 138.94,93.22 138.94,116.08 103.89,151.13 50.75,151.13 46.18,146.56 46.18,144.32
N$34
  Top 0.305: R8.2 18.8,159.28 LED3.A
N$38
  Top 0.406: U$3.6 44.98,153.78 C12.1
N$46
  Top 0.305: R10.2 LED2.A
N$71
  Top 0.305: C44.1 C52.1 C14.1 C51.1 C34.1 C50.1 C15.1 C17.1 C53.1 C13.1 97.03,161.8
  Top 7.62: 53.59,161.8 97.03,161.8 102.11,161.8 134.37,129.54 150.88,129.54
  pour Top (isolate 0.127, no thermals): 54.86,165.35 49.23,165.35 46.18,162.31 46.18,159.56 47.5,158.24 55.12,158.24 55.88,159 55.88,164.34
  pour Top (isolate 0.127): 148.34,133.1 154.18,133.1 155.7,131.57 155.7,127.51 154.18,125.98 148.34,125.98
N$98  (1 unrouted)
N$114
  Top 0.305: R15.1 144.86,150.65 R5.1 146.41,149.1 148.59,149.1 149.41,148.28 Q12.1
REC+1  (via drill 0.38)
  Top 0.305: U$24.A 128.65,181.48 127.51,182.63 122.68,182.63 120.4,180.34 120.4,178.44 R2.1
  Bot-Mid(Sig) 0.305: R2.1 121.92,176.66 121.92,97.28 127.38,91.82 U$5.1
  other vias: 120.27,178.31
REC-1  (via drill 0.38)
  Top 0.305: U$24.B 127.38,181.23 126.75,181.86 123.95,181.86 122.94,180.85 122.94,178.44 R2.2 v123.06,178.31
  Bot-Mid(Sig) 0.305: v123.06,178.31 123.06,98.42 128.4,93.09 U$5.2
RX1
  Top 0.305: 127.41,186.53 U$24.RO
  Top 0.406: 127.41,186.53 127.41,187.1 128.02,187.71 144.78,187.71 152.65,195.58 152.65,197.87 U$1.PC4
SIG-5V
  Top 0.305: U$1.PP2 136.14,150.37 138.18,148.34 R1.2
SIG-12V
  Top 0.305: U$1.PN3 138.68,150.71 R15.2
SIG-M1  (via drill 0.38)
  Top 0.406: v20.75,19.58 LT1910-M1.4
  Top-Mid(3.3) 0.305: U$1.PK7 72.64,158.24 71.63,159.26 38.1,159.26 37.08,158.24 37.08,22.61 34.06,19.58 v20.75,19.58
SIG-M2  (via drill 0.38)
  Top 0.406: v20.75,35.33 LT1910-M2.4
  Top-Mid(3.3) 0.305: U$1.PQ1 73.91,154.69 73.91,159 72.9,160.02 37.85,160.02 35.81,157.99 35.81,38.86 32.26,35.31 20.78,35.31 v20.75,35.33
SIG-M3  (via drill 0.38)
  Top 0.406: v20.75,51.08 LT1910-M3.4
  Top-Mid(3.3) 0.305: U$1.PK6 75.18,158.75 73.15,160.78 37.59,160.78 34.54,157.73 34.54,55.12 30.73,51.05 20.78,51.05 v20.75,51.08
SIG-M4  (via drill 0.38)
  Top 0.406: v20.75,66.83 LT1910-M4.4
  Top-Mid(3.3) 0.305: U$1.PP3 76.45,154.69 76.45,159 73.91,161.54 37.08,161.54 33.27,157.73 33.27,69.85 30.99,66.8 20.78,66.8 v20.75,66.83
SIG-M5  (via drill 0.38)
  Top 0.406: v20.75,82.58 LT1910-M5.4
  Top-Mid(3.3) 0.305: U$1.PH1 77.72,158.75 74.17,162.31 36.58,162.31 32,157.73 32,85.09 30.5,82.58 v20.75,82.58
SIG-M6  (via drill 0.38)
  Top 0.406: v20.75,98.32 LT1910-M6.4
  Top-Mid(3.3) 0.305: U$1.PH0 80.26,158.5 75.69,163.07 36.07,163.07 30.73,157.73 30.73,101.85 29.23,98.32 v20.75,98.32
SIG-M7  (via drill 0.38)
  Top 0.406: v20.75,114.07 LT1910-M7.4
  Top-Mid(3.3) 0.305: U$1.PA7 86.61,154.69 86.61,158.75 81.53,163.83 35.56,163.83 29.46,157.73 29.46,116.08 27.46,114.07 v20.75,114.07
SIG-M8  (via drill 0.38)
  Top 0.305: v20.83,129.79 20.83,127.73 LT1910-M8.4
  Top-Mid(3.3) 0.305: U$1.PP5 89.15,154.69 89.15,158.75 83.31,164.59 35.05,164.59 28.19,157.73 28.19,132.84 25.15,129.79 v20.83,129.79
SOURCE-M1
  Top 0.406: LEDRES-M1.1 24.64,11.68 TOPAPP-M1.P$2
  pour Top (isolate 0.127, no thermals): 27.94,17.78 27.94,10.92 25.65,8.64 22.86,8.64 20.83,10.67 20.83,14.73 23.88,17.78
SOURCE-M2
  Top 0.406: LEDRES-M2.1 24.64,27.43 TOPAPP-M2.P$2
  pour Top (isolate 0.127, no thermals): 27.94,33.53 27.94,26.67 25.65,24.38 22.86,24.38 20.83,26.42 20.83,30.48 23.88,33.53
SOURCE-M3
  Top 0.406: LEDRES-M3.1 24.64,43.18 TOPAPP-M3.P$2
  pour Top (isolate 0.127, no thermals): 27.94,49.28 27.94,42.42 25.65,40.13 22.86,40.13 20.83,42.16 20.83,46.23 23.88,49.28
SOURCE-M4
  Top 0.406: LEDRES-M4.1 24.64,58.93 TOPAPP-M4.P$2
  pour Top (isolate 0.127, no thermals): 27.94,65.02 27.94,58.17 25.65,55.88 22.86,55.88 20.83,57.91 20.83,61.98 23.88,65.02
SOURCE-M5
  Top 0.406: LEDRES-M5.1 24.64,74.68 TOPAPP-M5.P$2
  pour Top (isolate 0.127, no thermals): 27.94,80.77 27.94,73.91 25.65,71.63 22.86,71.63 20.83,73.66 20.83,77.72 23.88,80.77
SOURCE-M6
  Top 0.406: LEDRES-M6.1 24.64,90.42 TOPAPP-M6.P$2
  pour Top (isolate 0.127, no thermals): 27.94,96.77 27.94,89.66 25.65,87.38 22.86,87.38 20.83,89.41 20.83,93.73 23.88,96.77
SOURCE-M7
  Top 0.406: LEDRES-M7.1 24.64,106.17 TOPAPP-M7.P$2
  pour Top (isolate 0.127, no thermals): 27.94,112.52 27.94,105.41 25.65,103.12 22.86,103.12 20.83,105.16 20.83,109.47 23.88,112.52
SOURCE-M8
  Top 0.406: LEDRES-M8.1 24.64,121.92 TOPAPP-M8.P$2
  pour Top (isolate 0.127, no thermals): 27.94,128.52 27.94,121.16 25.65,118.87 22.86,118.87 20.83,120.9 20.83,125.48 23.88,128.52
TRANS+1  (via drill 0.38)
  Top 0.305: U$24.Y 124.84,178.81 R7.2
  Bot-Mid(Sig) 0.305: R7.2 125.35,101.73 132.72,94.36 U$5.3
  other vias: 125.35,178.31
TRANS-1  (via drill 0.38)
  Top 0.305: U$24.Z 126.11,180.34 R7.1 v128.14,178.31
  Bot-Mid(Sig) 0.305: v128.14,178.31 126.49,176.66 126.49,104.39 132.72,98.17 U$5.6
TX1
  Top 0.406: U$24.DI 126.11,187.58 127.25,188.72 143.26,188.72 150.11,195.58 150.11,197.87 U$1.PC5
V_BATT  (via drill 0.38)
  Top 0.305: R11.2 v136.91,146.05
  Top 0.406: R3.2 85.6,131.57
  Top-Mid(3.3) 0.305: v136.91,146.05 122.05,131.19 U$7.P$2
  pour Top (isolate 0.127, rank 2, no thermals): 50.55,133.6 50.55,6.9 55.7,1.75 87.38,1.75 87.38,126.36 102.62,126.36 103.63,127.25 103.63,132.59 102.62,133.6
  pour Top (isolate 0.127, no thermals): 45.97,21.08 45.97,16.76 50.55,16.76 50.55,21.08
  pour Top (isolate 0.127, no thermals): 45.97,36.83 45.97,32.51 50.55,32.51 50.55,36.83
  pour Top (isolate 0.127, no thermals): 45.97,52.58 45.97,48.26 50.55,48.26 50.55,52.58
  pour Top (isolate 0.127, no thermals): 45.97,68.33 45.97,64.01 50.55,64.01 50.55,68.33
  pour Top (isolate 0.127, no thermals): 45.97,84.07 45.97,79.76 50.55,79.76 50.55,84.07
  pour Top (isolate 0.127, no thermals): 45.97,99.82 45.97,95.5 50.55,95.5 50.55,99.82
  pour Top (isolate 0.127, no thermals): 45.97,115.57 45.97,111.25 50.55,111.25 50.55,115.57
  pour Top (isolate 0.127, no thermals): 45.97,131.32 45.97,127 50.55,127 50.55,131.32
  pour Top (isolate 0.127, no thermals): 86.87,124.97 89.92,124.97 90.42,124.46 90.42,123.44 89.92,122.94 86.87,122.94
  pour Top (isolate 0.127, no thermals): 86.87,113.28 89.92,113.28 90.42,112.78 90.42,111.76 89.92,111.25 86.87,111.25
  pour Top (isolate 0.127, no thermals): 81.53,71.63 136.14,71.63 138.68,69.09 138.68,29.97 136.4,27.69 81.53,27.69
VMEAS-VBATT  (via drill 0.38)
  Top 0.305: R3.1 86.87,138.07 | R4.2 86.87,138.07 | 86.87,138.07 v86.87,139.7
  Bot-Mid(Sig) 0.305: v86.87,139.7 86.87,148.34 86.11,149.1 41.91,149.1 39.88,151.13 39.88,180.85 42.67,183.64 86.87,183.64 95.25,192.02 141.73,192.02 U$1.PE3

### Text on the board
tPlace: GND | +5V | +12V | A2 | A1 | REY-5V | RS-485 | M6 | M5 | M4 | M3 | M2 | + - | ZENITH | M1 | Missouri S&T Mars Rover / Cameron Nichols / Power Board 2016 | + - / VPACK